# Altium project ghetto_cuda.PrjPcb (part 1 of 2)
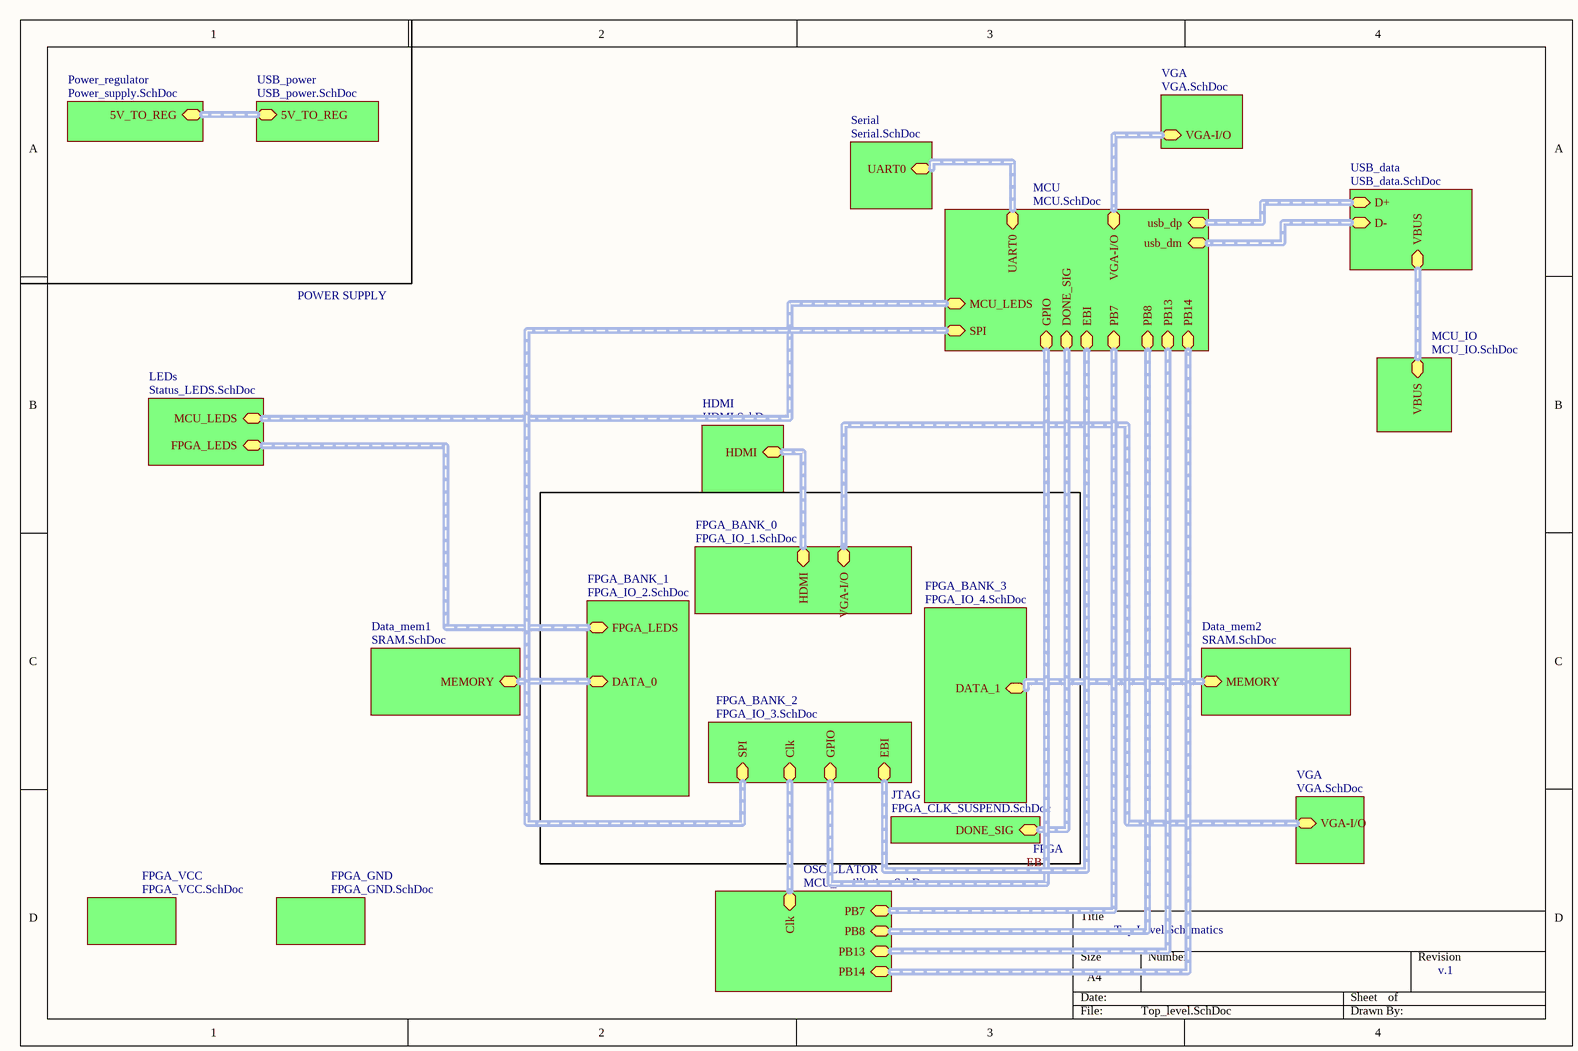
[diagram p0: Top_level.SchDoc]
19 sheets, 131 parts. Net scope: hierarchical (ports join the sheet entries above them; power ports are global).
Sheets:
  Top_level.SchDoc
    MCU = MCU.SchDoc
    USB_data = USB_data.SchDoc
    USB_power = USB_power.SchDoc
    Power_regulator = Power_supply.SchDoc
    FPGA_BANK_2 = FPGA_IO_3.SchDoc
    HDMI = HDMI.SchDoc
    VGA = VGA.SchDoc
    Data_mem1 = SRAM.SchDoc
    Serial = Serial.SchDoc
    VGA = VGA.SchDoc
    Data_mem2 = SRAM.SchDoc
    FPGA_BANK_0 = FPGA_IO_1.SchDoc
    FPGA_BANK_1 = FPGA_IO_2.SchDoc
    FPGA_BANK_3 = FPGA_IO_4.SchDoc
    JTAG = FPGA_CLK_SUSPEND.SchDoc
    FPGA_GND = FPGA_GND.SchDoc
    FPGA_VCC = FPGA_VCC.SchDoc
    LEDs = Status_LEDS.SchDoc
    MCU_IO = MCU_IO.SchDoc
    OSCILLATOR = MCU_oscilliation.SchDoc

## Sheet Top_level.SchDoc
size A4

### Sub-sheets
Data_mem1 = SRAM.SchDoc: MEMORY (harness MEMORY)
Data_mem2 = SRAM.SchDoc: MEMORY (harness MEMORY)
FPGA_BANK_0 = FPGA_IO_1.SchDoc: HDMI (harness HDMI), VGA-I/O (harness VGA-I/O)
FPGA_BANK_1 = FPGA_IO_2.SchDoc: DATA_0 (harness MEMORY), FPGA_LEDS (harness FPGA_LEDS)
FPGA_BANK_2 = FPGA_IO_3.SchDoc: EBI (harness EBI), SPI (harness SPI), Clk (harness FPGA-CLK), GPIO (harness GPIO)
FPGA_BANK_3 = FPGA_IO_4.SchDoc: DATA_1 (harness MEMORY)
FPGA_GND = FPGA_GND.SchDoc: no entries
FPGA_VCC = FPGA_VCC.SchDoc: no entries
HDMI = HDMI.SchDoc: HDMI (harness HDMI)
JTAG = FPGA_CLK_SUSPEND.SchDoc: DONE_SIG (harness DONE_SGN)
LEDs = Status_LEDS.SchDoc: MCU_LEDS (harness MCU_LEDS), FPGA_LEDS (harness FPGA_LEDS)
MCU = MCU.SchDoc: EBI (harness EBI), usb_dp (harness D+), VGA-I/O (harness VGA-I/O), usb_dm (harness D-), MCU_LEDS (harness MCU_LEDS), SPI (harness SPI), PB7 (harness PB7), PB8 (harness PB8), PB13 (harness CLK_signal), PB14 (harness CLK_signal), UART0 (harness UART0), DONE_SIG (harness DONE_SGN), GPIO (harness GPIO)
MCU_IO = MCU_IO.SchDoc: VBUS (harness VBUS)
OSCILLATOR = MCU_oscilliation.SchDoc: PB7 (harness PB7), PB13 (harness CLK_signal), PB14 (harness CLK_signal), PB8 (harness PB8), Clk (harness FPGA-CLK)
Power_regulator = Power_supply.SchDoc: 5V_TO_REG (harness 5V_TO_REG)
Serial = Serial.SchDoc: UART0 (harness UART0)
USB_data = USB_data.SchDoc: D+ (harness D+), D- (harness D-), VBUS (harness VBUS)
USB_power = USB_power.SchDoc: 5V_TO_REG (harness 5V_TO_REG)
VGA = VGA.SchDoc: VGA-I/O (harness VGA-I/O)
VGA = VGA.SchDoc: VGA-I/O (harness VGA-I/O)

### Buses and harness runs
harness EBI = sheet FPGA_BANK_2/EBI = sheet MCU/EBI
harness sheet Data_mem1/MEMORY = sheet FPGA_BANK_1/DATA_0
harness sheet Data_mem2/MEMORY = sheet FPGA_BANK_3/DATA_1
harness sheet FPGA_BANK_0/HDMI = sheet HDMI/HDMI
harness sheet FPGA_BANK_0/VGA-I/O = sheet VGA/VGA-I/O
harness sheet FPGA_BANK_1/FPGA_LEDS = sheet LEDs/FPGA_LEDS
harness sheet FPGA_BANK_2/Clk = sheet OSCILLATOR/Clk
harness sheet FPGA_BANK_2/GPIO = sheet MCU/GPIO
harness sheet FPGA_BANK_2/SPI = sheet MCU/SPI
harness sheet JTAG/DONE_SIG = sheet MCU/DONE_SIG
harness sheet LEDs/MCU_LEDS = sheet MCU/MCU_LEDS
harness sheet MCU/PB7 = sheet OSCILLATOR/PB7
harness sheet MCU/PB8 = sheet OSCILLATOR/PB8
harness sheet MCU/PB13 = sheet OSCILLATOR/PB13
harness sheet MCU/PB14 = sheet OSCILLATOR/PB14
harness sheet MCU/UART0 = sheet Serial/UART0
harness sheet MCU/usb_dm = sheet USB_data/D-
harness sheet MCU/usb_dp = sheet USB_data/D+
harness sheet MCU/VGA-I/O = sheet VGA/VGA-I/O
harness sheet MCU_IO/VBUS = sheet USB_data/VBUS
harness sheet Power_regulator/5V_TO_REG = sheet USB_power/5V_TO_REG

### Notes on the sheet
- POWER SUPPLY
- FPGA
- Top Level Schematics
- v.1

## Sheet MCU.SchDoc
size A
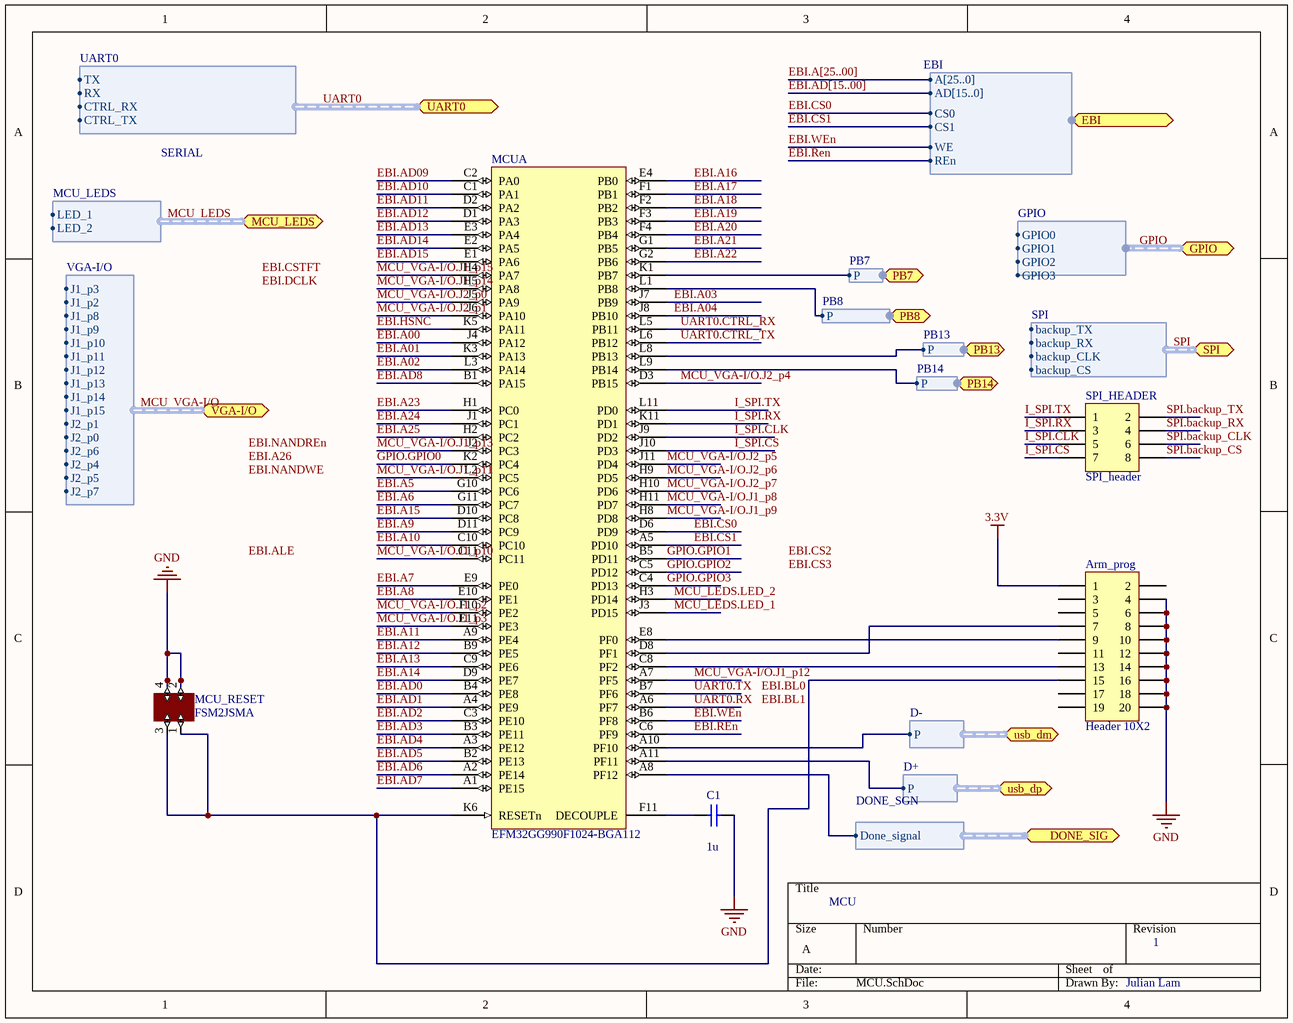
[diagram p1: MCU.SchDoc]

### Parts
Arm_prog  Header 10X2  [HDR2X10]
C1  value 1u  [C1206]
MCU  EFM32GG990F1024-BGA112  [ENMR-BGA112]  (part A of 2)
MCU_RESET  FSM2JSMA  [Button]
SPI_HEADER  SPI_header  [HDR2X4]

### Ports
DONE_SIG (harness DONE_SGN), EBI (harness EBI), GPIO (harness GPIO), MCU_LEDS (harness MCU_LEDS), PB7 (harness PB7), PB8 (harness PB8), PB13 (harness PB13), PB14 (harness PB14), SPI (harness SPI), UART0 (harness UART0), usb_dm (harness D-), usb_dp (harness D+), VGA-I/O (harness VGA-I/O)

### Harnesses
D-: P
D+: P
EBI: AD[15..0], A[25..0], CS0, WE, REn, CS1
PB7: P
PB8: P
PB13: P
PB14: P
SPI: backup_TX, backup_RX, backup_CLK, backup_CS
UART0: TX, RX, CTRL_RX, CTRL_TX
DONE_SGN: Done_signal
MCU_LEDS: LED_1, LED_2
VGA-I/O: J2_p7, J2_p5, J2_p4, J2_p6, J2_p0, J2_p1, J1_p15, J1_p14, J1_p13, J1_p12, J1_p11, J1_p10, J1_p9, J1_p8, J1_p2, J1_p3
GPIO: GPIO0, GPIO1, GPIO2, GPIO3

### Nets
3.3V: Arm_prog.1
GND: Arm_prog.4 Arm_prog.6 Arm_prog.8 Arm_prog.10 Arm_prog.12 Arm_prog.14 Arm_prog.16 Arm_prog.18 Arm_prog.20 C1.2 MCU_RESET.2 MCU_RESET.4
EBI.A00: MCU.J4(PA12)
EBI.A01: MCU.K3(PA13)
EBI.A02: MCU.L3(PA14)
EBI.A03: MCU.J7(PB9)
EBI.A04: MCU.J8(PB10)
EBI.A5: MCU.G10(PC6)
EBI.A6: MCU.G11(PC7)
EBI.A7: MCU.E9(PE0)
EBI.A8: MCU.E10(PE1)
EBI.A9: MCU.D11(PC9)
EBI.A10: MCU.C10(PC10)
EBI.A11: MCU.A9(PE4)
EBI.A12: MCU.B9(PE5)
EBI.A13: MCU.C9(PE6)
EBI.A14: MCU.D9(PE7)
EBI.A15: MCU.D10(PC8)
EBI.A16: MCU.E4(PB0)
EBI.A17: MCU.F1(PB1)
EBI.A18: MCU.F2(PB2)
EBI.A19: MCU.F3(PB3)
EBI.A20: MCU.F4(PB4)
EBI.A21: MCU.G1(PB5)
EBI.A22: MCU.G2(PB6)
EBI.A23: MCU.H1(PC0)
EBI.A24: MCU.J1(PC1)
EBI.A25: MCU.H2(PC2)
EBI.AD0: MCU.B4(PE8)  [project net DATA0]
EBI.AD1: MCU.A4(PE9)  [project net DATA1]
EBI.AD2: MCU.C3(PE10)  [project net DATA2]
EBI.AD3: MCU.B3(PE11)  [project net DATA3]
EBI.AD4: MCU.A3(PE12)  [project net DATA4]
EBI.AD5: MCU.B2(PE13)  [project net DATA5]
EBI.AD6: MCU.A2(PE14)  [project net DATA6]
EBI.AD7: MCU.A1(PE15)  [project net DATA7]
EBI.AD8: MCU.B1(PA15)  [project net DATA8]
EBI.AD09: MCU.C2(PA0)
EBI.AD10: MCU.C1(PA1)  [project net DATA10]
EBI.AD11: MCU.D2(PA2)  [project net DATA11]
EBI.AD12: MCU.D1(PA3)  [project net DATA12]
EBI.AD13: MCU.E3(PA4)  [project net DATA13]
EBI.AD14: MCU.E2(PA5)  [project net DATA14]
EBI.AD15: MCU.E1(PA6)  [project net DATA15]
EBI.CS0: MCU.D6(PD9) ; port EBI.CS0  [project net CS0]
EBI.CS1: MCU.A5(PD10) ; port EBI.CS1
EBI.HSNC: MCU.K5(PA11)
EBI.REn: MCU.C6(PF9) ; port EBI.REn
EBI.WEn: MCU.B6(PF8) ; port EBI.WE  [project net EBI.WE]
GPIO.GPIO0: MCU.K2(PC4)
GPIO.GPIO1: MCU.B5(PD11)
GPIO.GPIO2: MCU.C5(PD12)
GPIO.GPIO3: MCU.C4(PD13)
I_SPI.CLK: MCU.J9(PD2) SPI_HEADER.5
I_SPI.CS: MCU.J10(PD3) SPI_HEADER.7
I_SPI.RX: MCU.K11(PD1) SPI_HEADER.3
I_SPI.TX: MCU.L11(PD0) SPI_HEADER.1
MCU_LEDS.LED_1: MCU.J3(PD15)
MCU_LEDS.LED_2: MCU.H3(PD14)
MCU_VGA-I/O.J1_p2: MCU.F10(PE2)
MCU_VGA-I/O.J1_p3: MCU.E11(PE3)
MCU_VGA-I/O.J1_p8: MCU.H11(PD7)
MCU_VGA-I/O.J1_p9: MCU.H8(PD8)
MCU_VGA-I/O.J1_p10: MCU.C11(PC11)
MCU_VGA-I/O.J1_p11: MCU.L2(PC5)
MCU_VGA-I/O.J1_p12: MCU.A7(PF5)
MCU_VGA-I/O.J1_p13: MCU.J2(PC3)
MCU_VGA-I/O.J1_p14: MCU.H5(PA8)
MCU_VGA-I/O.J1_p15: MCU.H4(PA7)
MCU_VGA-I/O.J2_p0: MCU.J5(PA9)
MCU_VGA-I/O.J2_p1: MCU.J6(PA10)
MCU_VGA-I/O.J2_p4: MCU.D3(PB15)
MCU_VGA-I/O.J2_p5: MCU.J11(PD4)
MCU_VGA-I/O.J2_p6: MCU.H9(PD5)
MCU_VGA-I/O.J2_p7: MCU.H10(PD6)
SPI.backup_CLK: SPI_HEADER.6
SPI.backup_CS: SPI_HEADER.8
SPI.backup_RX: SPI_HEADER.4
SPI.backup_TX: SPI_HEADER.2
UART0.CTRL_RX: MCU.L5(PB11)
UART0.CTRL_TX: MCU.L6(PB12)
UART0.RX: MCU.A6(PF7)
UART0.TX: MCU.B7(PF6)
NetArm_prog_7: Arm_prog.7 MCU.D8(PF1)
NetArm_prog_9: Arm_prog.9 MCU.E8(PF0)
NetArm_prog_13: Arm_prog.13 MCU.C8(PF2)
NetArm_prog_15: Arm_prog.15 MCU.K6(RESETn) MCU_RESET.1 MCU_RESET.3
NetC1_1: C1.1 MCU.F11(DECOUPLE)
NetC21_2: MCU.K1(PB7) ; port PB7.P
NetC22_2: MCU.L1(PB8) ; port PB8.P
NetC23_2: MCU.L8(PB13) ; port PB13.P
NetC24_2: MCU.L9(PB14) ; port PB14.P
NetJTAG_1: MCU.A8(PF12) ; port DONE_SIG.Done_signal
NetL2_1: MCU.A10(PF10) ; port usb_dm.P
NetL2_4: MCU.A11(PF11) ; port usb_dp.P

Not connected (* = marked no-connect by the designer): Arm_prog 2 3 5 11 17 19

### Buses and harness runs
bus EBI.A[25..00]
bus EBI.AD[15..00]
harness GPIO = port GPIO
harness MCU_LEDS = port MCU_LEDS
harness MCU_VGA-I/O = port VGA-I/O
harness SPI = port SPI
harness UART0 = port UART0

### Notes on the sheet
- SERIAL
- MCU
- 1
- Julian Lam
- Labels drawn without touching a wire or pin: EBI.A26, EBI.ALE, EBI.BL0, EBI.BL1, EBI.CS2, EBI.CS3, EBI.CSTFT, EBI.DCLK, EBI.NANDREn, EBI.NANDWE

### Library data of the parts
Arm_prog = Header 10X2: Header, 10-Pin, Dual row; LatestRevisionDate: 17-Jul-2002; LatestRevisionNote: Re-released for DXP Platform.; Publisher: Altium Limited
C1 = Cap Semi: Capacitor (Semiconductor SIM Model); Published: 8-Jun-2000; LatestRevisionDate: 29-May-2009; LatestRevisionNote: IPC-7351 Footprint Added.; PackageReference: C1206; Publisher: Altium Limited; PackageDescription: Chip Capacitor
MCU = CMP-0270-00024-1: EFM32 Giant Gecko, M3 ARM Cortex CPU, 1024 KB Flash, 128 KB RAM, 1.85 - 3.8 V Supply, 48 MHz Max Speed, -40 to 85 degC, 112-Pin BGA, RoHS Compliant; LESENSE: Y; RAM (KB): 128; Flash (KB): 1024; LCD: 8x34; OPAMPS: 3; GPIO: 87; Max Speed (MHz): 48; ARM Cortex CPU: M3; DatasheetVersion: Rev 1.00; PartNumber: EFM32GG990F1024-BGA112; ComponentLink3Description: Package Specification; Subcategory: EFM32 Giant Gecko; PackageReference: BGA112; ComponentLink3URL: http://cdn.energymicro.com/dl/devices/pdf/d0007_efm32g290_datasheet.pdf; ComponentLink2Description: Datasheet; USB: Y; PackageDescription: 112-Pin Ball Grid Array, Body 10 x 10 mm, Pitch 0.8 mm; PackageVersion: Rev. 97SPP01315A_X03_06Jun11; ComponentLink1Description: Manufacturer URL; Supply Voltage (V): 1.85 - 3.8; Mounting Technology: Surface Mount; ComponentLink1URL: http://www.energymicro.com/; Generic Part Number: EFM32GG990; ComponentLink2URL: http://cdn.energymicro.com/dl/devices/pdf/d0046_efm32gg990_datasheet.pdf
MCU_RESET = switch-button: Reset button
SPI_HEADER = Header 4X2: Header, 4-Pin, Dual row; LatestRevisionDate: 17-Jul-2002; LatestRevisionNote: Re-released for DXP Platform.; Publisher: Altium Limited

## Sheet USB_data.SchDoc
size A4
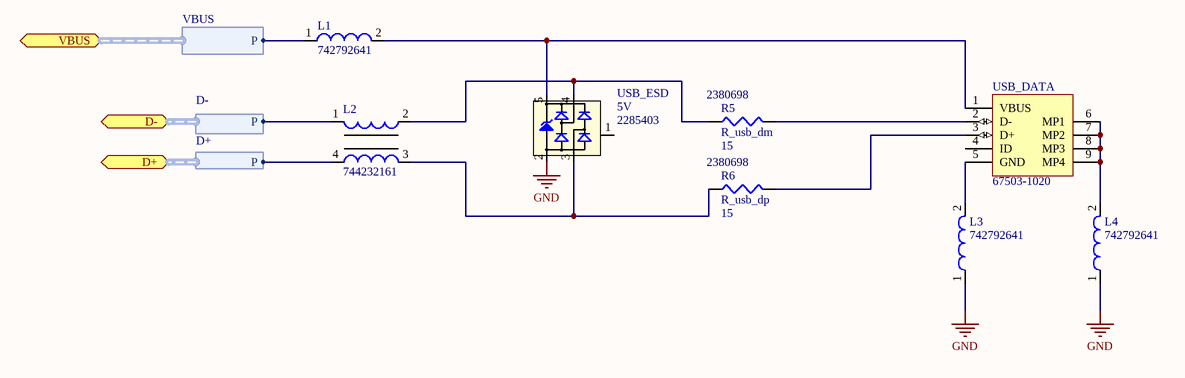
[diagram p2: USB_data.SchDoc]

### Parts
L1  742792641  [SMD-0603]
L2  744232161  [WE-CNSW-1206]
L3  742792641  [SMD-0603]
L4  742792641  [SMD-0603]
R5  R_usb_dm  value 15  Supplier Part Number 1: 2380698  [14-1210]
R6  R_usb_dp  value 15  Supplier Part Number 1: 2380698  [14-1210]
USB_DATA  67503-1020  [MOLX-67503-1020_V]
USB_ESD  5V  Supplier Part Number 1: 2285403  [SOT95P275X140-5N]

### Ports
D+ (harness D+), D- (harness D-), VBUS (harness VBUS)

### Harnesses
VBUS: P
D-: P
D+: P

### Nets
GND: L3.1 L4.1 USB_ESD.2(GND)
NetC17_2: L1.1 ; port VBUS.P
NetL1_2: L1.2 USB_DATA.1(VBUS) USB_ESD.5(VDD)
NetL2_1: L2.1 ; port D-.P
NetL2_2: L2.2 R5.1 USB_ESD.4(I/O2)
NetL2_3: L2.3 R6.1 USB_ESD.3(I/O1)
NetL2_4: L2.4 ; port D+.P
NetL3_2: L3.2 USB_DATA.5(GND)
NetL4_2: L4.2 USB_DATA.6(MP1) USB_DATA.7(MP2) USB_DATA.8(MP3) USB_DATA.9(MP4)
NetR5_2: R5.2 USB_DATA.2(D-)
NetR6_2: R6.2 USB_DATA.3(D+)

Not connected (* = marked no-connect by the designer): USB_DATA 4(ID); USB_ESD 1(NC)

### Library data of the parts
L1 L3 L4 = CMP-0220-00171-1: SMD EMI Suppression Ferrite Bead WE-CBF, Z = 300 Ohm; Impedance: 300 Ohm; PackageReference: SMD-0603; PackageVersion: 2009; ComponentLink2Description: Datasheet; ComponentLink2URL: http://www.we-online.de/katalog/media/pdf/742792641.pdf; ComponentLink1Description: Manufacturer Link; ComponentLink1URL: http://www.we-online.com; DatasheetVersion: Dec-2005; PackageDescription: Chip Inductor, 2-Leads, Body 1.6 x 0.8 mm
L2 = CMP-0222-00033-1: SMD Common Mode Noise Suppressor WE-CNSW, Z = 160 Ohm; Impedance: 160 Ohm; ComponentLink1Description: Manufacturer Link; DatasheetVersion: ver 3, Oct-2004; PackageReference: WE-CNSW-1206; PackageDescription: SMD Inductor, 4-Leads, Body 1.8 x 3.4 mm; ComponentLink1URL: http://www.we-online.com; ComponentLink2Description: Datasheet; PackageVersion: 2004; ComponentLink2URL: http://www.we-online.de/katalog/media/pdf/744232161.pdf
R5 R6 = Res3: Resistor; Manufacturer: PANASONIC; Manufacturer Part Number: ERJU14F15R0U; Product Range: PANASONIC - ERJ Series; Power Rating: 500; Resistance Tolerance: ± 1%; Resistor Case Style: 1210 [3225 Metric]; Resistor Element Material: Thick Film; Temperature Coefficient: ± 100; Voltage Rating: 200; SVHC: No SVHC (16-Dec-2013; Published: 8-Jun-2000; LatestRevisionDate: 29-May-2009; LatestRevisionNote: IPC-7351 Footprint Added.; PackageReference: J1-0603; Publisher: Altium Limited; PackageDescription: Chip Resistor; Supplier 1: Farnell; RoHS: YES; Stock 1: 3740; Pricing 1: 10=1,05, 100=0,951, 500=0,734, 1000=0,589, 5000=0,434 (EUR); Resistance: 15; Packaging: Cut Tape; MSL: -; ComponentLink1URL: http://www.farnell.com/datasheets/1783557.pdf; ComponentLink1Description: http://www.farnell.com/datasheets/1783557.pdf
USB_DATA = CMP-0411-00002-1: USB, MINI, SMD, RA KME04-USBMU03A01; Manufacturer: Molex; ComponentLink1URL: http://www.molex.com/; PartNumber: 67503-1020; Mounting Technology: Surface Mount; ComponentLink1Description: Manufacturer URL; Terminal Pitch: 0.8 mm; DatasheetVersion: Rev F, 06/2009; ComponentLink2Description: Datasheet; PackageDescription: Mini USB Connector, SMT, Righer Angle; ComponentLink2URL: http://www.molex.com/pdm_docs/sd/675031020_sd.pdf; PackageReference: 67503-1020
USB_ESD = WE-TVS-HS,SOT23-5L,824011: TVS Diode WE-TVS-HS, VRWM=5V; PartNo: 824011; Manufacturer: Würth Elektronik eiSos GmbH; Manufacturer Part Number: DZ5X068D0R; Reverse Stand Off Voltage: 5V; ComponentLink1Description: Manufacturer; ComponentLink1URL: http://www.we-online.de; Created by: Christin Zierenner; Created Date: March 2010; ComponentLink2Description: Datasheet; ComponentLink2URL: http://katalog.we-online.de/kataloge/eisos/media/pdf/824011.pdf; Supplier 1: Farnell; RoHS: YES; Stock 1: 901; Pricing 1: 1=1,2, 25=0,93, 100=0,77, 500=0,74, 1000=0,73, 3000=0,71, 3000=0,639, 40000=0,615 (EUR); ComponentLink3URL: http://www.semicon.panasonic.co.jp/ds4/DZ5X068D_BED.pdf; ComponentLink3Description: http://www.semicon.panasonic.co.jp/ds4/DZ5X068D_BED.pdf

## Sheet USB_power.SchDoc
size A4
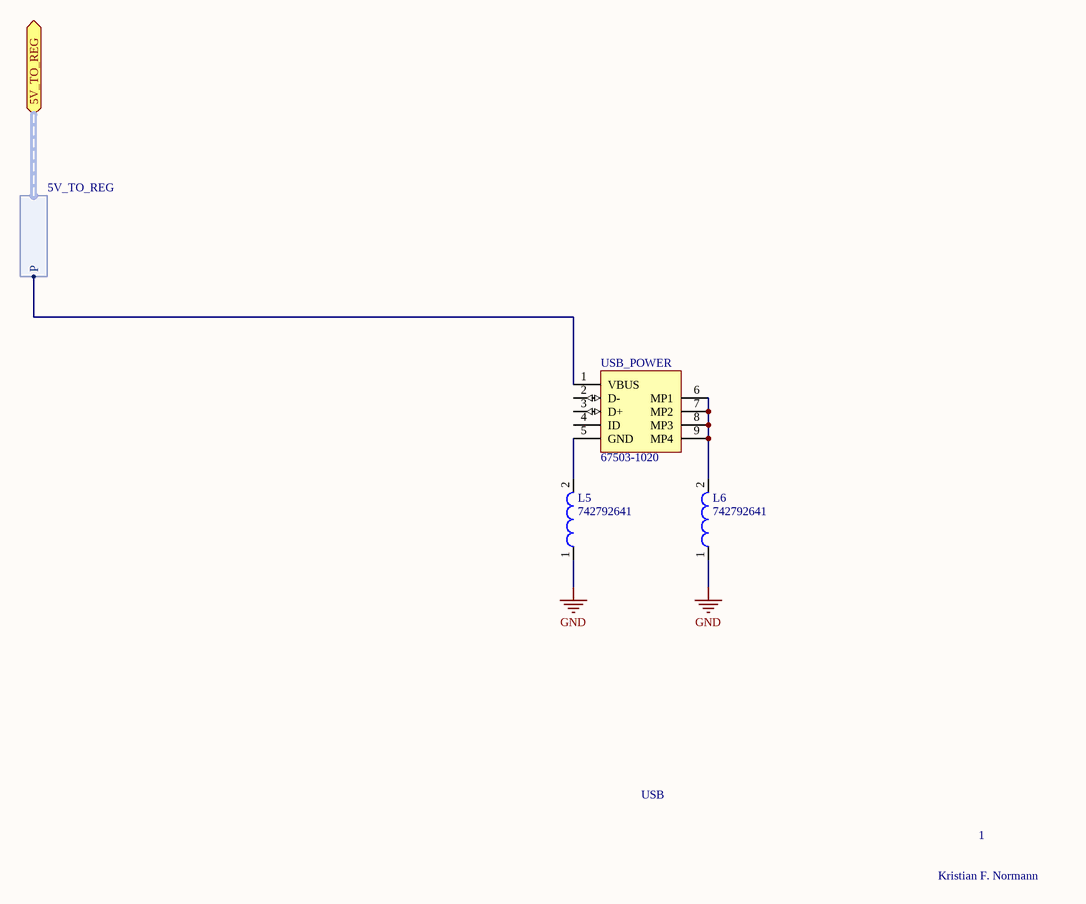
[diagram p3: USB_power.SchDoc]

### Parts
L5  742792641  [SMD-0603]
L6  742792641  [SMD-0603]
USB_POWER  67503-1020  [MOLX-67503-1020_V]

### Ports
5V_TO_REG (harness 5V_TO_REG)

### Harnesses
5V_TO_REG: P

### Nets
GND: L5.1 L6.1
NetL5_2: L5.2 USB_POWER.5(GND)
NetL6_2: L6.2 USB_POWER.6(MP1) USB_POWER.7(MP2) USB_POWER.8(MP3) USB_POWER.9(MP4)
NetP5_1: USB_POWER.1(VBUS) ; port 5V_TO_REG.P

Not connected (* = marked no-connect by the designer): USB_POWER 2(D-) 3(D+) 4(ID)

### Notes on the sheet
- USB
- 1
- Kristian F. Normann

### Library data of the parts
L5 L6 = CMP-0220-00171-1: as L1 on sheet USB_data; PackageReference: SMD-0603; PackageVersion: 2009; ComponentLink2Description: Datasheet; ComponentLink2URL: http://www.we-online.de/katalog/media/pdf/742792641.pdf; ComponentLink1Description: Manufacturer Link; ComponentLink1URL: http://www.we-online.com; DatasheetVersion: Dec-2005; PackageDescription: Chip Inductor, 2-Leads, Body 1.6 x 0.8 mm
USB_POWER = CMP-0411-00002-1: as USB_DATA on sheet USB_data; ComponentLink1URL: http://www.molex.com/; PartNumber: 67503-1020; Mounting Technology: Surface Mount; ComponentLink1Description: Manufacturer URL; Terminal Pitch: 0.8 mm; DatasheetVersion: Rev F, 06/2009; ComponentLink2Description: Datasheet; PackageDescription: Mini USB Connector, SMT, Righer Angle; ComponentLink2URL: http://www.molex.com/pdm_docs/sd/675031020_sd.pdf; PackageReference: 67503-1020

## Sheet Power_supply.SchDoc
size A4
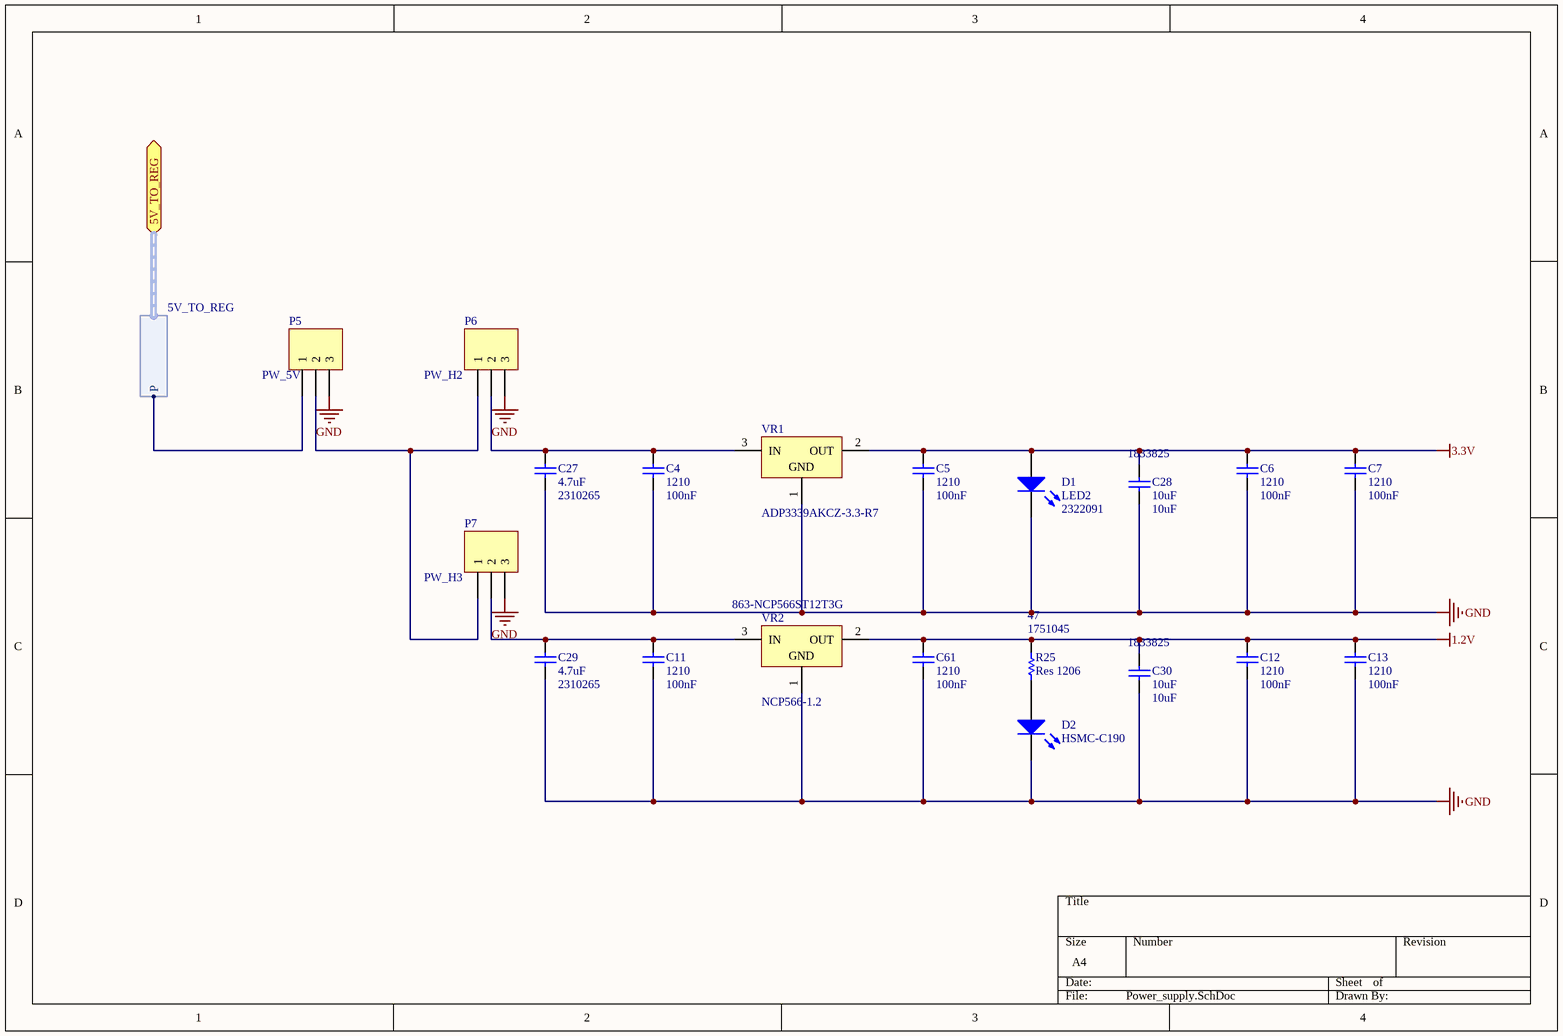
[diagram p4: Power_supply.SchDoc]

### Parts
C4  1210  value 100nF  [CAPC1210(3225)105_L]
C5  1210  value 100nF  [CAPC1210(3225)105_L]
C6  1210  value 100nF  [CAPC1210(3225)105_L]
C7  1210  value 100nF  [CAPC1210(3225)105_L]
C11  1210  value 100nF  [CAPC1210(3225)105_L]
C12  1210  value 100nF  [CAPC1210(3225)105_L]
C13  1210  value 100nF  [CAPC1210(3225)105_L]
C27  4.7uF  Supplier Part Number 1: 2310265  [C1206]
C28  10uF  Supplier Part Number 1: 1833825  [C1206]
C29  4.7uF  Supplier Part Number 1: 2310265  [C1206]
C30  10uF  Supplier Part Number 1: 1833825  [C1206]
C61  1210  value 100nF  [CAPC1210(3225)105_L]
D1  LED2  Supplier Part Number 1: 2322091  [C1206]
D2  HSMC-C190  [1.6X0.8X0.8]
P5  PW_5V  [HDR1X3]
P6  PW_H2  [HDR1X3]
P7  PW_H3  [HDR1X3]
R25  Res 1206  Supplier Part Number 1: 1751045  Resistance: 47  [RESC1206(3216)_L]
VR1  ADP3339AKCZ-3.3-R7  [ADI-KC-3_M]
VR2  NCP566-1.2  Supplier Part Number 1: 863-NCP566ST12T3G  [SOT223_N]

### Ports
5V_TO_REG (harness 5V_TO_REG)

### Harnesses
5V_TO_REG: P

### Nets
1.2V: C12.2 C13.2 C30.2 C61.2 R25.1 VR2.2(OUT)
3.3V: C5.2 C6.2 C7.2 C28.2 D1.1(A) VR1.2(OUT)
GND: C4.1 C5.1 C6.1 C7.1 C11.1 C12.1 C13.1 C27.1 C28.1 C29.1 C30.1 C61.1 D1.2(K) D2.2(K) P5.3 P6.3 P7.3 VR1.1(GND) VR2.1(GND)
NetC4_2: C4.2 C27.2 P6.2 VR1.3(IN)
NetC11_2: C11.2 C29.2 P7.2 VR2.3(IN)
NetD2_1: D2.1(A) R25.2
NetP5_1: P5.1 ; port 5V_TO_REG.P
NetP5_2: P5.2 P6.1 P7.1

### Library data of the parts
C4-C7 C11-C13 C61 = CMP-1038-01663-1: CAP 100nF 100V ±5% 1210 (3225 Metric) Thickness 1.05mm SMD; Case-Metric: 3225; Max Thickness: 1.05 mm; Rated Voltage: 100 V; Tolerance: ±5%; Case-EIA: 1210; Technology: SMT
C27 C29 = Cap Semi: Capacitor (Semiconductor SIM Model); Manufacturer: AVX; Manufacturer Part Number: 12061Z475KAT2A; Value: 100pF; Capacitance: 4.7; Capacitance Tolerance: ± 10%; Dielectric Characteristic: X7; Voltage Rating: 100; Ceramic Capacitor Case: 1206 [3216 Metric]; SVHC: No SVHC (16-Jun-2014); Capacitor Terminals: SMD<!--FANDB--><div class="features-and-benefits-container"></div>; Published: 8-Jun-2000; LatestRevisionDate: 29-May-2009; LatestRevisionNote: IPC-7351 Footprint Added.; PackageReference: C1206; Publisher: Altium Limited; PackageDescription: Chip Capacitor; Supplier 1: Farnell; RoHS: YES; Stock 1: 213; Pricing 1: 1=6,85, 50=6,2, 100=4,8, 1000=3,85, 2000=2,45 (EUR); Product Range: -; Operating Temperature Min: -55; Operating Temperature Max: 125; Packaging: Cut Tape; MSL: MSL 1 - Unlimited; Capacitance Tolerance ±: ± 10%; Capacitor Case Style: 1206 [3216 Metric]; ComponentLink1URL: http://www.farnell.com/datasheets/1789384.pdf; ComponentLink1Description: http://www.farnell.com/datasheets/1789384.pdf
C28 C30 = Cap Semi: Capacitor (Semiconductor SIM Model); Manufacturer: AVX; Manufacturer Part Number: 12063D106KAT2A; Capacitance: 10; Capacitance Tolerance: ± 10%; Dielectric Characteristic: X5; Voltage Rating: 25; Ceramic Capacitor Case: 1206 [3216 Metric]; SVHC: No SVHC (16-Dec-2013); Capacitor Terminals: SMD; Published: 8-Jun-2000; LatestRevisionDate: 29-May-2009; LatestRevisionNote: IPC-7351 Footprint Added.; PackageReference: C1206; Publisher: Altium Limited; PackageDescription: Chip Capacitor; Value: 10uF; Supplier 1: Farnell; RoHS: YES; Stock 1: 16889; Pricing 1: 10=3.58, 100=2.42, 500=1.21, 1000=1, 2000=0.8 (EUR); Product Range: -; Operating Temperature Min: -55; Operating Temperature Max: 85; Packaging: Cut Tape; MSL: MSL 1 - Unlimited; Capacitance Tolerance ±: ± 10%; Capacitor Case Style: 1206 [3216 Metric]; Operating Temperature Range: -55°C to +85; Series: Hi-Cap MLCC<!--FANDB--><div class="features-and-benefits-container"></div>; ComponentLink1URL: http://www.farnell.com/datasheets/1796776.pdf; ComponentLink1Description: http://www.farnell.com/datasheets/1796776.pdf
D1 = LED2: Typical RED, GREEN, YELLOW, AMBER GaAs LED; Manufacturer: WURTH ELEKTRONIK; Manufacturer Part Number: 156120GS75300; Published: 8-Jun-2000; LatestRevisionDate: 17-Jul-2002; LatestRevisionNote: Re-released for DXP Platform.; PackageVersion: Feb-2002; PackageReference: 3.2X1.6X1.1; Publisher: Altium Limited; PackageDescription: SM LED; 2 Flat Leads; Supplier 1: Farnell; RoHS: YES; Stock 1: 15358; Pricing 1: 1=5,3, 50=4,9, 100=4,6, 500=3,65, 2000=3,3, 5000=2,95, 5000=2,65, 30000=2,4 (EUR); ComponentLink1URL: http://katalog.we-online.de/led/datasheet/156120GS75300.pdf; ComponentLink1Description: http://katalog.we-online.de/led/datasheet/156120GS75300.pdf
D2 = HSMC-C190: High Performance Chip LED, Red; LuminousIntensity: 25mcd (Minimum).; PCB_Layout: Complies with manufacturer's recommendation.; Published: 11-Dec-2002; DatasheetVersion: 11-Mar-2002; PackageVersion: Mar-2002; PackageReference: 1.6X0.8X0.8; Publisher: Altium Limited; PackageDescription: SM LED; 2 Flat Leads; LED_Colour: Red; ComponentLink1Description: Manufacturer Link; ComponentLink1URL: http://www.avagotech.com/; ComponentLink2Description: Datasheet; ComponentLink2URL: http://cp.literature.agilent.com/litweb/pdf/5988-5891EN.pdf
P5-P7 = Header 3: Header, 3-Pin; LatestRevisionDate: 17-Jul-2002; LatestRevisionNote: Re-released for DXP Platform.; Publisher: Altium Limited
R25 = CMP-1014-00056-1: 105R 0.25W 5% 1206 (3216 Metric)  SMD; Manufacturer: PANASONIC; Manufacturer Part Number: ERJB2AF470V; Case-Metric: 3216; Case-EIA: 1206; Product Range: PANASONIC - ERJ Wide Terminal Series; Power Rating: 0.5; Resistance Tolerance: ± 1%; Resistor Case Style: 1206 Wide; Resistor Element Material: Thick Film; Temperature Coefficient: ± 100; Voltage Rating: 200; SVHC: No SVHC (16-Dec-2013); External Depth: 1.6; External Length / Height: 0.65; External Width: 3.2; No. of Pins: 2; Overload Voltage: 400; Reel Quantity: 5000; Technology: SMT; Tolerance: 5 %; Value: 105R; Power: 0.25 W; Supplier 1: Farnell; RoHS: YES; Stock 1: 185; Pricing 1: 5=1,83, 50=1,71, 100=1,61, 500=1,52, 5000=1,44 (EUR); Packaging: Cut Tape; MSL: -; Operating Temperature Max: 155; Operating Temperature Min: -55; Operating Temperature Range: -55°C to +155; Resistor Mounting: SMD; Series: ERJ<!--FANDB--><div class="features-and-benefits-container"></div>; ComponentLink1URL: http://www.farnell.com/datasheets/436795.pdf; ComponentLink1Description: http://www.farnell.com/datasheets/436795.pdf; ComponentLink2URL: http://www.farnell.com/datasheets/1718548.pdf; ComponentLink2Description: http://www.farnell.com/datasheets/1718548.pdf; ComponentLink3URL: http://www.farnell.com/cad/1697905.zip; ComponentLink3Description: http://www.farnell.com/cad/1697905.zip
VR1 = CMP-0786-00156-1: High Accuracy, Ultralow IQ, 1.5 A, anyCAP Low Dropout Regulator, 2.8 to 6 V Vin, 3.3 V Vout, Industrial, 3-pin SOT223 (KC-3), Reel; Manufacturer: Analog Devices; Vin (max) (V): 6; Supply Current IGND @ Small Load: 130uA; Iout max: 1.5A; Preset Vout Values (V): 3.3; Vin (min) (V): 2.8; Code_JEDEC: TO-261-AA; ComponentLink3URL: http:/www.analog.com/static/imported-files/packages/PKG_PDF/SOT_223(KC)/KC_3.pdf; ComponentLink4URL: Product URL:http://www.analog.com/en/ADP3339/productSearch.html; Mounting Technology: Surface Mount; ComponentLink2URL: http://www.analog.com/static/imported-files/data_sheets/ADP3339.pdf; DatasheetVersion: Rev. C; ComponentLink1URL: http://www.analog.com/en/index.html; PackageDescription: 3-Pin Small Outline Transistor Package, Body 3.5 x 6.5 mm, Pitch 2.3 mm; Packing: Reel; PartNumber: ADP3339AKCZ-3.3-R7; ComponentLink3Description: Package Specification; PackageReference: KC-3; ComponentLink1Description: Manufacturer URL; ComponentLink2Description: Datasheet; PackageVersion: 11-20-2012-B, 11/2012; ComponentLink4Description: URL Link1
VR2 = LM1084IT-3.3: 5A Low Dropout Positive Regulators, 3-pin TO-220; Manufacturer: ON Semiconductor; Manufacturer Part Number: NCP566ST12T3G; Input Voltage MAX: 9 V; Number of Outputs: 1 Output; Output Current: 1.5 A; Output Type: Fixed; Output Voltage: 1.2 V; Dropout Voltage - Max: 1.3 V at 1.5 mA; Voltage Regulation Accuracy: 3 %; Line Regulation: 0.02 %; Load Regulation: 0.04 %; Reference Voltage: 0.9 V; Supplier 1: Mouser; RoHS: RoHS Compliant; Category: LDO Voltage Regulators; Stock 1: 3461; Pricing 1: 1=1.42, 10=1.13, 100=0.871, 500=0.770, 1000=0.608, 4000=0.539, 8000=0.518, 24000=0.502 (AUD); Package / Case: SOT-223; Packaging: Reel; Series: NCP566; Brand: ON Semiconductor; Mounting Style: SMD/SMT; Maximum Operating Temperature: + 125 C; Minimum Operating Temperature: - 40 C; Product Category: Amplifiers- Audio; Standard Pack Qty: 4000; RoHS - Mouser: Y; Minimum Order Quantity: 1; Reeling: True; ComponentLink1URL: http://www.farnell.com/datasheets/115299.pdf; ComponentLink1Description: http://www.farnell.com/datasheets/115299.pdf

## Sheet FPGA_IO_3.SchDoc
size A
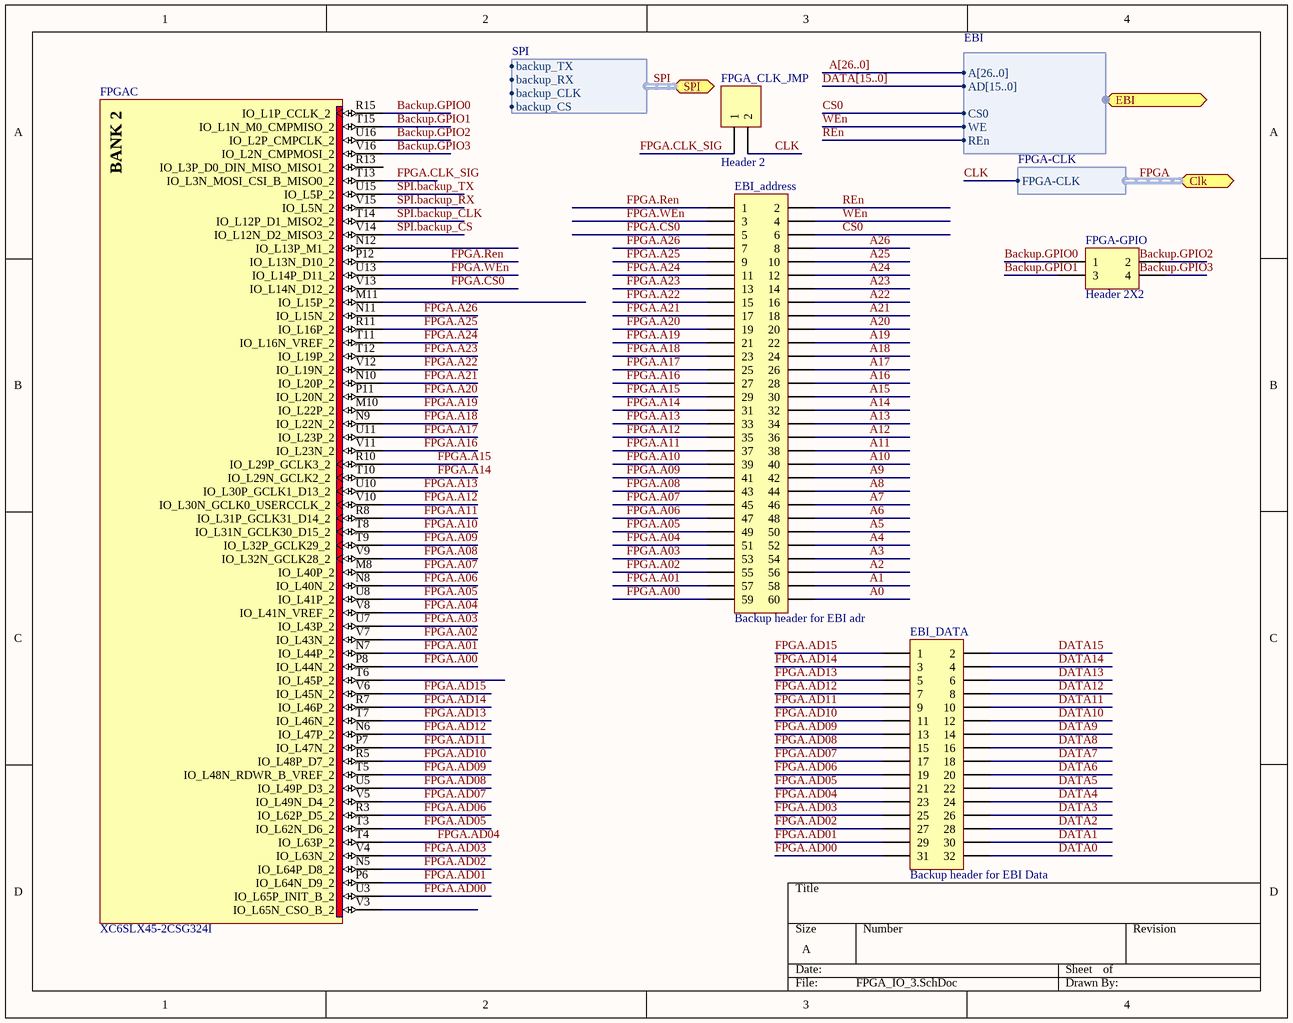
[diagram p5: FPGA_IO_3.SchDoc]

### Parts
EBI_address  Backup header for EBI adr  [HDR2X30]
EBI_DATA  Backup header for EBI Data  [HDR2X16]
FPGA  XC6SLX45-2CSG324I  [CSG324]  (part C of 8)
FPGA-GPIO  Header 2X2  [HDR2X2]
FPGA_CLK_JMP  Header 2  [HDR1X2]

### Ports
Clk (harness FPGA-CLK), EBI (harness EBI), SPI (harness SPI)

### Harnesses
EBI: AD[15..0], A[26..0], CS0, WE, REn
FPGA-CLK: FPGA-CLK
SPI: backup_TX, backup_RX, backup_CLK, backup_CS

### Nets
A0: EBI_address.60
A1: EBI_address.58
A2: EBI_address.56
A3: EBI_address.54
A4: EBI_address.52
A5: EBI_address.50
A6: EBI_address.48
A7: EBI_address.46
A8: EBI_address.44
A9: EBI_address.42
A10: EBI_address.40
A11: EBI_address.38
A12: EBI_address.36
A13: EBI_address.34
A14: EBI_address.32
A15: EBI_address.30
A16: EBI_address.28
A17: EBI_address.26
A18: EBI_address.24
A19: EBI_address.22
A20: EBI_address.20
A21: EBI_address.18
A22: EBI_address.16
A23: EBI_address.14
A24: EBI_address.12
A25: EBI_address.10
A26: EBI_address.8
Backup.GPIO0: FPGA.R15(IO_L1P_CCLK_2) FPGA-GPIO.1
Backup.GPIO1: FPGA.T15(IO_L1N_M0_CMPMISO_2) FPGA-GPIO.3
Backup.GPIO2: FPGA.U16(IO_L2P_CMPCLK_2)
Backup.GPIO3: FPGA.V16(IO_L2N_CMPMOSI_2)
CLK: FPGA_CLK_JMP.2 ; port Clk.FPGA-CLK
CS0: EBI_address.6 ; port EBI.CS0
DATA0: EBI_DATA.32
DATA1: EBI_DATA.30
DATA2: EBI_DATA.28
DATA3: EBI_DATA.26
DATA4: EBI_DATA.24
DATA5: EBI_DATA.22
DATA6: EBI_DATA.20
DATA7: EBI_DATA.18
DATA8: EBI_DATA.16
DATA9: EBI_DATA.14
DATA10: EBI_DATA.12
DATA11: EBI_DATA.10
DATA12: EBI_DATA.8
DATA13: EBI_DATA.6
DATA14: EBI_DATA.4
DATA15: EBI_DATA.2
FPGA.A00: EBI_address.59 FPGA.P8(IO_L44N_2)
FPGA.A01: EBI_address.57 FPGA.N7(IO_L44P_2)
FPGA.A02: EBI_address.55 FPGA.V7(IO_L43N_2)
FPGA.A03: EBI_address.53 FPGA.U7(IO_L43P_2)
FPGA.A04: EBI_address.51 FPGA.V8(IO_L41N_VREF_2)
FPGA.A05: EBI_address.49 FPGA.U8(IO_L41P_2)
FPGA.A06: EBI_address.47 FPGA.N8(IO_L40N_2)
FPGA.A07: EBI_address.45 FPGA.M8(IO_L40P_2)
FPGA.A08: EBI_address.43 FPGA.V9(IO_L32N_GCLK28_2)
FPGA.A09: EBI_address.41 FPGA.T9(IO_L32P_GCLK29_2)
FPGA.A10: EBI_address.39 FPGA.T8(IO_L31N_GCLK30_D15_2)
FPGA.A11: EBI_address.37 FPGA.R8(IO_L31P_GCLK31_D14_2)
FPGA.A12: EBI_address.35 FPGA.V10(IO_L30N_GCLK0_USERCCLK_2)
FPGA.A13: EBI_address.33 FPGA.U10(IO_L30P_GCLK1_D13_2)
FPGA.A14: EBI_address.31 FPGA.T10(IO_L29N_GCLK2_2)
FPGA.A15: EBI_address.29 FPGA.R10(IO_L29P_GCLK3_2)
FPGA.A16: EBI_address.27 FPGA.V11(IO_L23N_2)
FPGA.A17: EBI_address.25 FPGA.U11(IO_L23P_2)
FPGA.A18: EBI_address.23 FPGA.N9(IO_L22N_2)
FPGA.A19: EBI_address.21 FPGA.M10(IO_L22P_2)
FPGA.A20: EBI_address.19 FPGA.P11(IO_L20N_2)
FPGA.A21: EBI_address.17 FPGA.N10(IO_L20P_2)
FPGA.A22: EBI_address.15 FPGA.V12(IO_L19N_2)
FPGA.A23: EBI_address.13 FPGA.T12(IO_L19P_2)
FPGA.A24: EBI_address.11 FPGA.T11(IO_L16N_VREF_2)
FPGA.A25: EBI_address.9 FPGA.R11(IO_L16P_2)
FPGA.A26: EBI_address.7 FPGA.N11(IO_L15N_2)
FPGA.AD00: EBI_DATA.31 FPGA.U3(IO_L65P_INIT_B_2)
FPGA.AD01: EBI_DATA.29 FPGA.P6(IO_L64N_D9_2)
FPGA.AD02: EBI_DATA.27 FPGA.N5(IO_L64P_D8_2)
FPGA.AD03: EBI_DATA.25 FPGA.V4(IO_L63N_2)
FPGA.AD04: EBI_DATA.23 FPGA.T4(IO_L63P_2)
FPGA.AD05: EBI_DATA.21 FPGA.T3(IO_L62N_D6_2)
FPGA.AD06: EBI_DATA.19 FPGA.R3(IO_L62P_D5_2)
FPGA.AD07: EBI_DATA.17 FPGA.V5(IO_L49N_D4_2)
FPGA.AD08: EBI_DATA.15 FPGA.U5(IO_L49P_D3_2)
FPGA.AD09: EBI_DATA.13 FPGA.T5(IO_L48N_RDWR_B_VREF_2)
FPGA.AD10: EBI_DATA.11 FPGA.R5(IO_L48P_D7_2)
FPGA.AD11: EBI_DATA.9 FPGA.P7(IO_L47N_2)
FPGA.AD12: EBI_DATA.7 FPGA.N6(IO_L47P_2)
FPGA.AD13: EBI_DATA.5 FPGA.T7(IO_L46N_2)
FPGA.AD14: EBI_DATA.3 FPGA.R7(IO_L46P_2)
FPGA.AD15: EBI_DATA.1 FPGA.V6(IO_L45N_2)
FPGA.CLK_SIG: FPGA.T13(IO_L3N_MOSI_CSI_B_MISO0_2) FPGA_CLK_JMP.1
FPGA.CS0: EBI_address.5 FPGA.V13(IO_L14N_D12_2)
FPGA.Ren: EBI_address.1 FPGA.P12(IO_L13N_D10_2)
FPGA.WEn: EBI_address.3 FPGA.U13(IO_L14P_D11_2)
REn: EBI_address.2 ; port EBI.REn  [project net EBI.REn]
SPI.backup_CLK: FPGA.T14(IO_L12P_D1_MISO2_2)
SPI.backup_CS: FPGA.V14(IO_L12N_D2_MISO3_2)
SPI.backup_RX: FPGA.V15(IO_L5N_2)
SPI.backup_TX: FPGA.U15(IO_L5P_2)
WEn: EBI_address.4 ; port EBI.WE  [project net EBI.WE]

Not connected (* = marked no-connect by the designer): FPGA M11(IO_L15P_2) N12(IO_L13P_M1_2) R13(IO_L3P_D0_DIN_MISO_MISO1_2) T6(IO_L45P_2) V3(IO_L65N_CSO_B_2); FPGA-GPIO 2 4

### Buses and harness runs
bus A[26..0]
bus DATA[15..0]
harness FPGA = port Clk
harness SPI = port SPI

### Notes on the sheet
- Labels drawn without touching a wire or pin: Backup.GPIO2, Backup.GPIO3
- (in symbol CMP-0067-00402-1, part C) BANK 2

### Library data of the parts
EBI_address = Header 30X2: Header, 30-Pin, Dual row; LatestRevisionDate: 17-Jul-2002; LatestRevisionNote: Re-released for DXP Platform.; Publisher: Altium Limited
EBI_DATA = Header 16X2: Header, 16-Pin, Dual row; LatestRevisionDate: 17-Jul-2002; LatestRevisionNote: Re-released for DXP Platform.; Publisher: Altium Limited
FPGA = CMP-0067-00402-1: Spartan-6 LX 1.2V FPGA, 218 User I/Os, 324-Ball Chip-Scale BGA (0.8mm Pitch), Speed Grade 2, Industrial Grade, Pb-Free; Code_JEDEC: MO-275-KKAC-1; PackageDescription: 324-Ball Chip-Scale BGA (CSG324) Package, 0.8 mm Pitch; DatasheetVersion: ver1.6, Nov-2010; PackageVersion: ver1.1, Nov-2009; PackageReference: CSG324
FPGA-GPIO = Header 2X2: Header, 2-Pin, Dual row; LatestRevisionDate: 17-Jul-2002; LatestRevisionNote: Re-released for DXP Platform.; Publisher: Altium Limited
FPGA_CLK_JMP = Header 2: Header, 2-Pin; LatestRevisionDate: 17-Jul-2002; LatestRevisionNote: Re-released for DXP Platform.; Publisher: Altium Limited

## Sheet HDMI.SchDoc
size A4
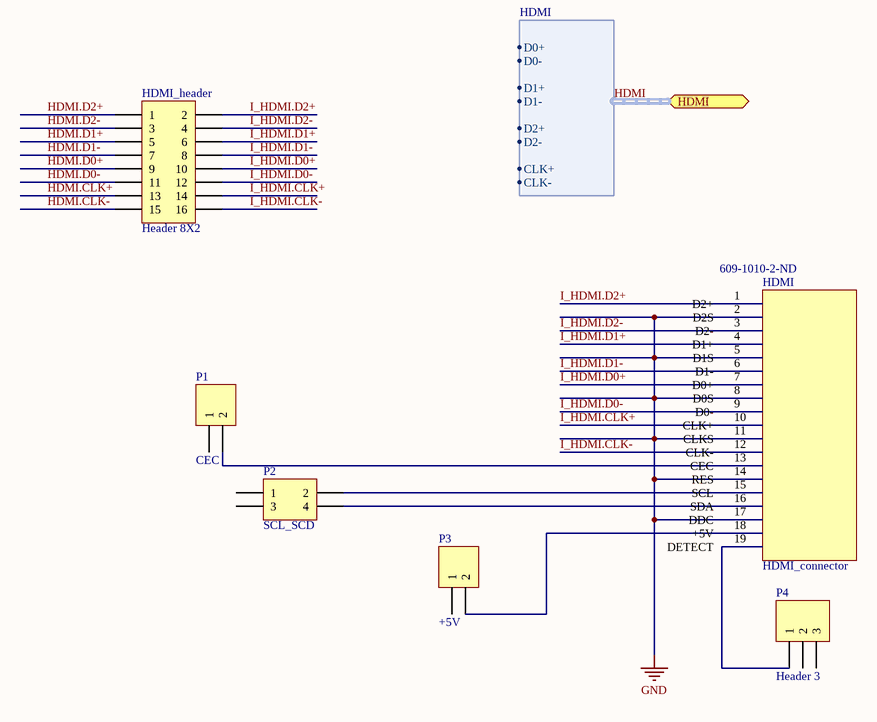
[diagram p6: HDMI.SchDoc]

### Parts
HDMI  HDMI_connector  Supplier Part Number 1: 609-1010-2-ND  [HDMI-type-A]
HDMI_header  Header 8X2  [HDR2X8]
P1  CEC  [HDR1X2]
P2  SCL_SCD  [HDR2X2]
P3  +5V  [HDR1X2]
P4  Header 3  [HDR1X3]

### Ports
HDMI (harness HDMI)

### Harnesses
HDMI: D0+, D0-, D1+, D1-, D2+, D2-, CLK+, CLK-

### Nets
GND: HDMI.2(D2S) HDMI.5(D1S) HDMI.8(D0S) HDMI.11(CLKS) HDMI.14(RES) HDMI.17(DDC)
HDMI.CLK+: HDMI_header.13
HDMI.CLK-: HDMI_header.15
HDMI.D0+: HDMI_header.9
HDMI.D0-: HDMI_header.11
HDMI.D1+: HDMI_header.5
HDMI.D1-: HDMI_header.7
HDMI.D2+: HDMI_header.1
HDMI.D2-: HDMI_header.3
I_HDMI.CLK+: HDMI.10(CLK+) HDMI_header.14
I_HDMI.CLK-: HDMI.12(CLK-) HDMI_header.16
I_HDMI.D0+: HDMI.7(D0+) HDMI_header.10
I_HDMI.D0-: HDMI.9(D0-) HDMI_header.12
I_HDMI.D1+: HDMI.4(D1+) HDMI_header.6
I_HDMI.D1-: HDMI.6(D1-) HDMI_header.8
I_HDMI.D2+: HDMI.1(D2+) HDMI_header.2
I_HDMI.D2-: HDMI.3(D2-) HDMI_header.4
NetHDMI_13: HDMI.13(CEC) P1.2
NetHDMI_15: HDMI.15(SCL) P2.2
NetHDMI_16: HDMI.16(SDA) P2.4
NetHDMI_18: HDMI.18(+5V) P3.2
NetHDMI_19: HDMI.19(DETECT) P4.1

Not connected (* = marked no-connect by the designer): P1 1; P2 1 3; P3 1; P4 2 3

### Buses and harness runs
harness HDMI = port HDMI

### Library data of the parts
HDMI = HDMI_connector: Manufacturer: FCI; Manufacturer Part Number: 10029449-001RLF; Connector Type: HDMI; Number of Contacts: 19; Gender: Receptacle; Supplier 1: Digi-Key; RoHS: RoHS Compliant; Category: Connectors, Interconnects; Stock 1: 12400; Pricing 1: 400=0.69795, 800=0.61071, 1200=0.55837, 2000=0.52347, 2800=0.50601, 10000=0.46414, 20000=0.45367 (EUR); Packaging: Tape & Reel (TR); Specifications: -; Mounting Type: Surface Mount, Right Angle, Horizontal; Features: -; Ingress Protection: -; ComponentLink1URL: http://portal.fciconnect.com/Comergent//fci/drawing/10029449.pdf; ComponentLink1Description: http://portal.fciconnect.com/Comergent//fci/drawing/10029449.pdf
HDMI_header = Header 8X2: Header, 8-Pin, Dual row; LatestRevisionDate: 17-Jul-2002; LatestRevisionNote: Re-released for DXP Platform.; Publisher: Altium Limited
P1 P3 = Header 2: Header, 2-Pin; LatestRevisionDate: 17-Jul-2002; LatestRevisionNote: Re-released for DXP Platform.; Publisher: Altium Limited
P2 = Header 2X2: Header, 2-Pin, Dual row; LatestRevisionDate: 17-Jul-2002; LatestRevisionNote: Re-released for DXP Platform.; Publisher: Altium Limited
P4 = Header 3: Header, 3-Pin; LatestRevisionDate: 17-Jul-2002; LatestRevisionNote: Re-released for DXP Platform.; Publisher: Altium Limited

## Sheet VGA.SchDoc
size A4
Used 2 times, as channels VGA, VGA. Parts and nets are listed once, with the designators drawn on the sheet.
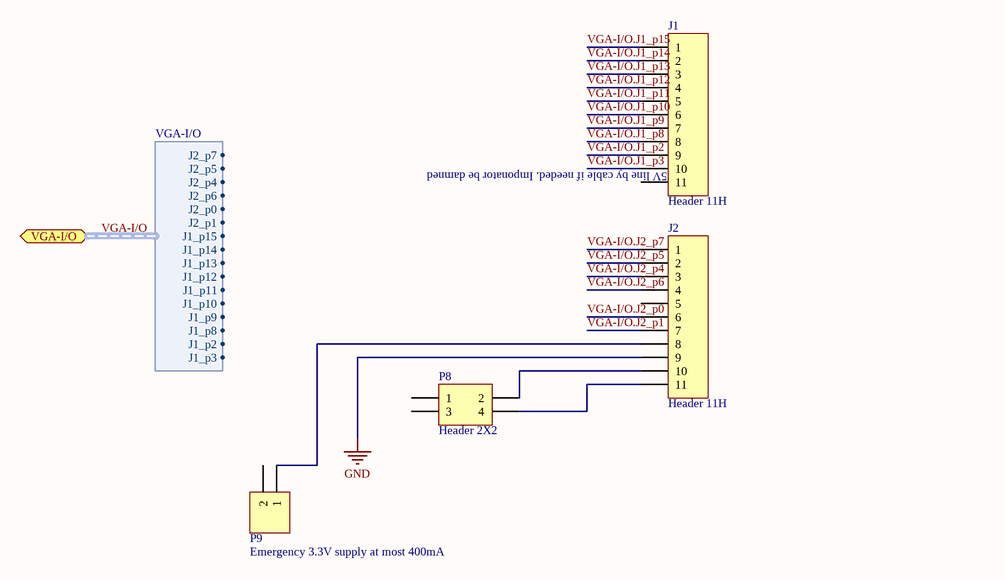
[diagram p7: VGA.SchDoc]

### Parts
J1  Header 11H  [HDR1X11H]
J2  Header 11H  [HDR1X11H]
P8  Header 2X2  [HDR2X2]
P9  Emergency 3.3V supply at most 400mA  [HDR1X2]

### Ports
VGA-I/O (harness VGA-I/O)

### Harnesses
VGA-I/O: J2_p7, J2_p5, J2_p4, J2_p6, J2_p0, J2_p1, J1_p15, J1_p14, J1_p13, J1_p12, J1_p11, J1_p10, J1_p9, J1_p8, J1_p2, J1_p3

### Nets
GND: J2.9
VGA-I/O.J1_p2: J1.9
VGA-I/O.J1_p3: J1.10
VGA-I/O.J1_p8: J1.8
VGA-I/O.J1_p9: J1.7
VGA-I/O.J1_p10: J1.6
VGA-I/O.J1_p11: J1.5
VGA-I/O.J1_p12: J1.4
VGA-I/O.J1_p13: J1.3
VGA-I/O.J1_p14: J1.2
VGA-I/O.J1_p15: J1.1
VGA-I/O.J2_p0: J2.6
VGA-I/O.J2_p1: J2.7
VGA-I/O.J2_p4: J2.3
VGA-I/O.J2_p5: J2.2
VGA-I/O.J2_p6: J2.4
VGA-I/O.J2_p7: J2.1
NetJ2_8: J2.8 P9.1
NetJ2_10: J2.10 P8.2
NetJ2_11: J2.11 P8.4

Not connected (* = marked no-connect by the designer): J1 11; J2 5; P8 1 3; P9 2

### Channels
VGA: designators end in _VGA#1
VGA: designators end in _VGA#2

### Buses and harness runs
harness VGA-I/O = port VGA-I/O

### Notes on the sheet
- (near J1) 5V line by cable if needed. Imponator be damned

### Library data of the parts
J1 J2 = Header 11H: Header, 11-Pin, Right Angle; LatestRevisionDate: 17-Jul-2002; LatestRevisionNote: Re-released for DXP Platform.; Publisher: Altium Limited
P8 = Header 2X2: Header, 2-Pin, Dual row; LatestRevisionDate: 17-Jul-2002; LatestRevisionNote: Re-released for DXP Platform.; Publisher: Altium Limited
P9 = Header 2: Header, 2-Pin; LatestRevisionDate: 17-Jul-2002; LatestRevisionNote: Re-released for DXP Platform.; Publisher: Altium Limited

## Sheet SRAM.SchDoc
size A
Used 2 times, as channels Data_mem1, Data_mem2. Parts and nets are listed once, with the designators drawn on the sheet.
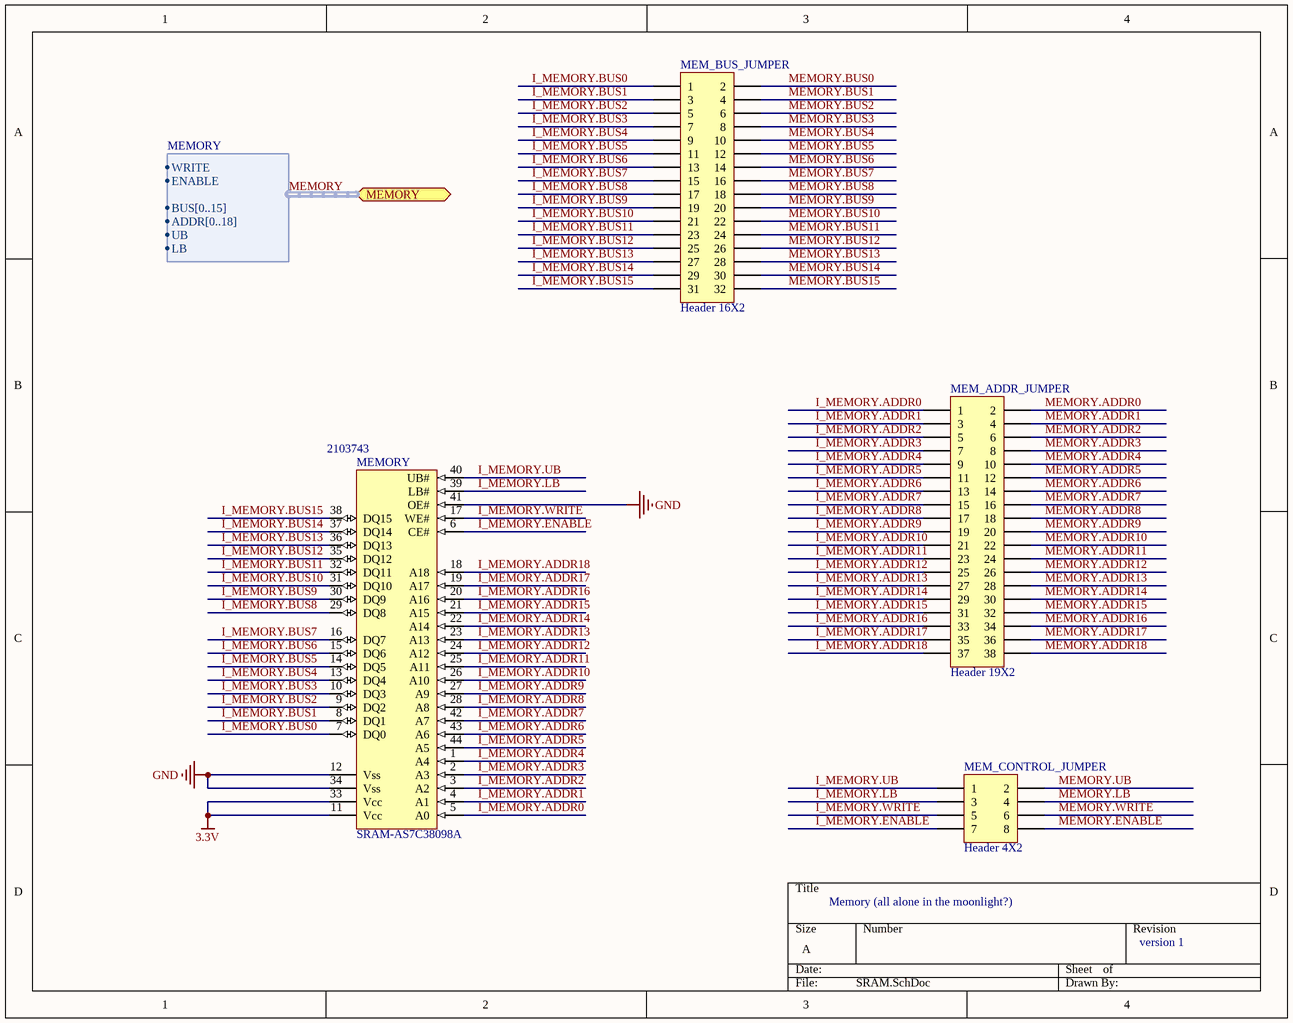
[diagram p8: SRAM.SchDoc]

### Parts
MEM_ADDR_JUMPER  Header 19X2  [HDR2X19]
MEM_BUS_JUMPER  Header 16X2  [HDR2X16]
MEM_CONTROL_JUMPER  Header 4X2  [HDR2X4]
MEMORY  SRAM-AS7C38098A  Supplier Part Number 1: 2103743  [AS7C38098A-10TIN]

### Ports
MEMORY (harness MEMORY)

### Harnesses
MEMORY: WRITE, ENABLE, BUS[0..15], ADDR[0..18], UB, LB

### Nets
3.3V: MEMORY.11(Vcc) MEMORY.33(Vcc)
GND: MEMORY.12(Vss) MEMORY.34(Vss) MEMORY.41(OE#)
I_MEMORY.ADDR0: MEM_ADDR_JUMPER.1 MEMORY.5(A0)
I_MEMORY.ADDR1: MEM_ADDR_JUMPER.3 MEMORY.4(A1)
I_MEMORY.ADDR2: MEM_ADDR_JUMPER.5 MEMORY.3(A2)
I_MEMORY.ADDR3: MEM_ADDR_JUMPER.7 MEMORY.2(A3)
I_MEMORY.ADDR4: MEM_ADDR_JUMPER.9 MEMORY.1(A4)
I_MEMORY.ADDR5: MEM_ADDR_JUMPER.11 MEMORY.44(A5)
I_MEMORY.ADDR6: MEM_ADDR_JUMPER.13 MEMORY.43(A6)
I_MEMORY.ADDR7: MEM_ADDR_JUMPER.15 MEMORY.42(A7)
I_MEMORY.ADDR8: MEM_ADDR_JUMPER.17 MEMORY.28(A8)
I_MEMORY.ADDR9: MEM_ADDR_JUMPER.19 MEMORY.27(A9)
I_MEMORY.ADDR10: MEM_ADDR_JUMPER.21 MEMORY.26(A10)
I_MEMORY.ADDR11: MEM_ADDR_JUMPER.23 MEMORY.25(A11)
I_MEMORY.ADDR12: MEM_ADDR_JUMPER.25 MEMORY.24(A12)
I_MEMORY.ADDR13: MEM_ADDR_JUMPER.27 MEMORY.23(A13)
I_MEMORY.ADDR14: MEM_ADDR_JUMPER.29 MEMORY.22(A14)
I_MEMORY.ADDR15: MEM_ADDR_JUMPER.31 MEMORY.21(A15)
I_MEMORY.ADDR16: MEM_ADDR_JUMPER.33 MEMORY.20(A16)
I_MEMORY.ADDR17: MEM_ADDR_JUMPER.35 MEMORY.19(A17)
I_MEMORY.ADDR18: MEM_ADDR_JUMPER.37 MEMORY.18(A18)
I_MEMORY.BUS0: MEM_BUS_JUMPER.1 MEMORY.7(DQ0)
I_MEMORY.BUS1: MEM_BUS_JUMPER.3 MEMORY.8(DQ1)
I_MEMORY.BUS2: MEM_BUS_JUMPER.5 MEMORY.9(DQ2)
I_MEMORY.BUS3: MEM_BUS_JUMPER.7 MEMORY.10(DQ3)
I_MEMORY.BUS4: MEM_BUS_JUMPER.9 MEMORY.13(DQ4)
I_MEMORY.BUS5: MEM_BUS_JUMPER.11 MEMORY.14(DQ5)
I_MEMORY.BUS6: MEM_BUS_JUMPER.13 MEMORY.15(DQ6)
I_MEMORY.BUS7: MEM_BUS_JUMPER.15 MEMORY.16(DQ7)
I_MEMORY.BUS8: MEM_BUS_JUMPER.17 MEMORY.29(DQ8)
I_MEMORY.BUS9: MEM_BUS_JUMPER.19 MEMORY.30(DQ9)
I_MEMORY.BUS10: MEM_BUS_JUMPER.21 MEMORY.31(DQ10)
I_MEMORY.BUS11: MEM_BUS_JUMPER.23 MEMORY.32(DQ11)
I_MEMORY.BUS12: MEM_BUS_JUMPER.25 MEMORY.35(DQ12)
I_MEMORY.BUS13: MEM_BUS_JUMPER.27 MEMORY.36(DQ13)
I_MEMORY.BUS14: MEM_BUS_JUMPER.29 MEMORY.37(DQ14)
I_MEMORY.BUS15: MEM_BUS_JUMPER.31 MEMORY.38(DQ15)
I_MEMORY.ENABLE: MEM_CONTROL_JUMPER.7 MEMORY.6(CE#)
I_MEMORY.LB: MEM_CONTROL_JUMPER.3 MEMORY.39(LB#)
I_MEMORY.UB: MEM_CONTROL_JUMPER.1 MEMORY.40(UB#)
I_MEMORY.WRITE: MEM_CONTROL_JUMPER.5 MEMORY.17(WE#)
MEMORY.ADDR0: MEM_ADDR_JUMPER.2
MEMORY.ADDR1: MEM_ADDR_JUMPER.4
MEMORY.ADDR2: MEM_ADDR_JUMPER.6
MEMORY.ADDR3: MEM_ADDR_JUMPER.8
MEMORY.ADDR4: MEM_ADDR_JUMPER.10
MEMORY.ADDR5: MEM_ADDR_JUMPER.12
MEMORY.ADDR6: MEM_ADDR_JUMPER.14
MEMORY.ADDR7: MEM_ADDR_JUMPER.16
MEMORY.ADDR8: MEM_ADDR_JUMPER.18
MEMORY.ADDR9: MEM_ADDR_JUMPER.20
MEMORY.ADDR10: MEM_ADDR_JUMPER.22
MEMORY.ADDR11: MEM_ADDR_JUMPER.24
MEMORY.ADDR12: MEM_ADDR_JUMPER.26
MEMORY.ADDR13: MEM_ADDR_JUMPER.28
MEMORY.ADDR14: MEM_ADDR_JUMPER.30
MEMORY.ADDR15: MEM_ADDR_JUMPER.32
MEMORY.ADDR16: MEM_ADDR_JUMPER.34
MEMORY.ADDR17: MEM_ADDR_JUMPER.36
MEMORY.ADDR18: MEM_ADDR_JUMPER.38
MEMORY.BUS0: MEM_BUS_JUMPER.2
MEMORY.BUS1: MEM_BUS_JUMPER.4
MEMORY.BUS2: MEM_BUS_JUMPER.6
MEMORY.BUS3: MEM_BUS_JUMPER.8
MEMORY.BUS4: MEM_BUS_JUMPER.10
MEMORY.BUS5: MEM_BUS_JUMPER.12
MEMORY.BUS6: MEM_BUS_JUMPER.14
MEMORY.BUS7: MEM_BUS_JUMPER.16
MEMORY.BUS8: MEM_BUS_JUMPER.18
MEMORY.BUS9: MEM_BUS_JUMPER.20
MEMORY.BUS10: MEM_BUS_JUMPER.22
MEMORY.BUS11: MEM_BUS_JUMPER.24
MEMORY.BUS12: MEM_BUS_JUMPER.26
MEMORY.BUS13: MEM_BUS_JUMPER.28
MEMORY.BUS14: MEM_BUS_JUMPER.30
MEMORY.BUS15: MEM_BUS_JUMPER.32
MEMORY.ENABLE: MEM_CONTROL_JUMPER.8
MEMORY.LB: MEM_CONTROL_JUMPER.4
MEMORY.UB: MEM_CONTROL_JUMPER.2
MEMORY.WRITE: MEM_CONTROL_JUMPER.6

### Channels
Data_mem1: designators end in _Data_mem1
Data_mem2: designators end in _Data_mem2

### Buses and harness runs
harness MEMORY = port MEMORY

### Notes on the sheet
- Memory (all alone in the moonlight?)
- version 1

### Library data of the parts
MEM_ADDR_JUMPER = Header 19X2: Header, 19-Pin, Dual row; LatestRevisionDate: 17-Jul-2002; LatestRevisionNote: Re-released for DXP Platform.; Publisher: Altium Limited
MEM_BUS_JUMPER = Header 16X2: Header, 16-Pin, Dual row; LatestRevisionDate: 17-Jul-2002; LatestRevisionNote: Re-released for DXP Platform.; Publisher: Altium Limited
MEM_CONTROL_JUMPER = Header 4X2: Header, 4-Pin, Dual row; LatestRevisionDate: 17-Jul-2002; LatestRevisionNote: Re-released for DXP Platform.; Publisher: Altium Limited
MEMORY = memchip-AS7C38098A: Manufacturer: ALLIANCE MEMORY; Description: ALLIANCE MEMORY - AS7C38098A-10TIN - SRAM, 8MBIT, 512KX16, 3.3V, 44TSOPII; Memory Size: 8; Memory Configuration: 512K x 16; Supply Voltage Min: 2.7; Supply Voltage Max: 3.6; Memory Case Style: TSOP-II; No. of Pins: 44; Access Time: 10; Supply Voltage Range: 2.7V to 3.6; Supplier 1: Farnell; Manufacturer Part Number: AS7C38098A-10TIN; RoHS: YES; Stock 1: 76; Pricing 1: 1=105,75, 10=104, 100=83,85, 250=82,2, 500=80,55, 900=78,95 (EUR); Operating Temperature Min: -40; Operating Temperature Max: 85; Packaging: Each; MSL: MSL 3 - 168 hours; Operating Temperature Range: -40°C to +85; ComponentLink1URL: http://www.alliancememory.com/pdf/sram/fa/as7c38098a.pdf; ComponentLink1Description: http://www.alliancememory.com/pdf/sram/fa/as7c38098a.pdf

## Sheet Serial.SchDoc
size A
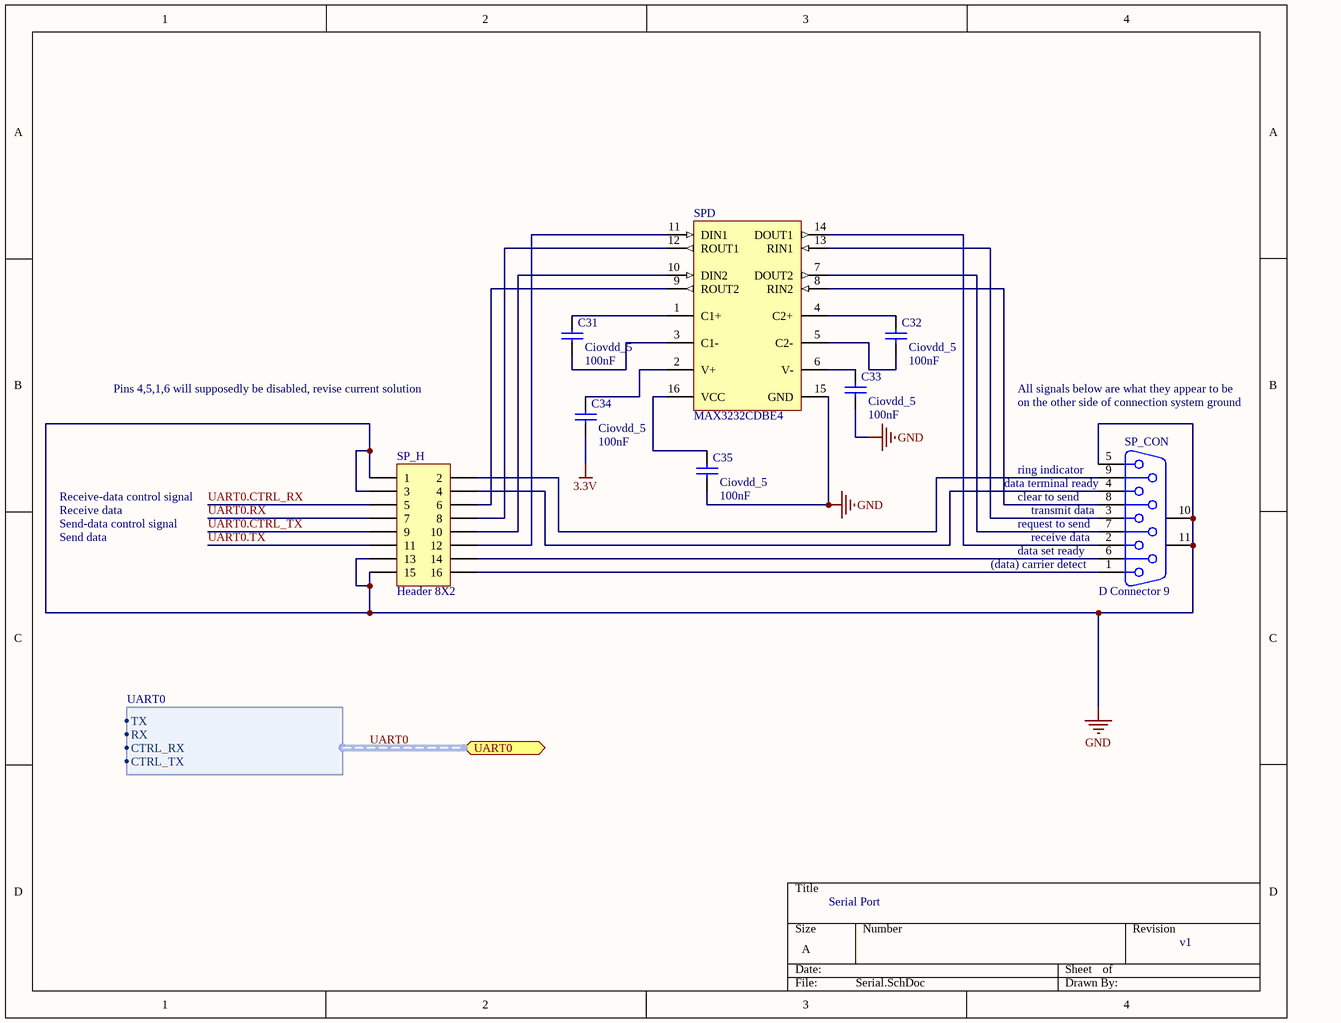
[diagram p9: Serial.SchDoc]

### Parts
C31  Ciovdd_5  value 100nF  [C1206]
C32  Ciovdd_5  value 100nF  [C1206]
C33  Ciovdd_5  value 100nF  [C1206]
C34  Ciovdd_5  value 100nF  [C1206]
C35  Ciovdd_5  value 100nF  [C1206]
SP_CON  D Connector 9  [DSUB1.385-2H9]
SP_H  Header 8X2  [HDR2X8]
SPD  MAX3232CDBE4  [TI-DB16_L]

### Ports
UART0 (harness UART0)

### Harnesses
UART0: TX, RX, CTRL_RX, CTRL_TX

### Nets
3.3V: C34.1
GND: C33.1 C35.1 SP_CON.5 SP_CON.10(MH1) SP_CON.11(MH2) SP_H.1 SP_H.3 SP_H.13 SP_H.15 SPD.15(GND)
UART0.CTRL_RX: SP_H.5
UART0.CTRL_TX: SP_H.9
UART0.RX: SP_H.7
UART0.TX: SP_H.11
NetC31_1: C31.1 SPD.3(C1-)
NetC31_2: C31.2 SPD.1(C1+)
NetC32_1: C32.1 SPD.5(C2-)
NetC32_2: C32.2 SPD.4(C2+)
NetC33_2: C33.2 SPD.6(V-)
NetC34_2: C34.2 SPD.2(V+)
NetC35_2: C35.2 SPD.16(VCC)
NetSP_CON_1: SP_CON.1 SP_H.16
NetSP_CON_2: SP_CON.2 SPD.14(DOUT1)
NetSP_CON_3: SP_CON.3 SPD.13(RIN1)
NetSP_CON_4: SP_CON.4 SP_H.4
NetSP_CON_6: SP_CON.6 SP_H.14
NetSP_CON_7: SP_CON.7 SPD.7(DOUT2)
NetSP_CON_8: SP_CON.8 SPD.8(RIN2)
NetSP_CON_9: SP_CON.9 SP_H.2
NetSP_H_6: SP_H.6 SPD.9(ROUT2)
NetSP_H_8: SP_H.8 SPD.12(ROUT1)
NetSP_H_10: SP_H.10 SPD.10(DIN2)
NetSP_H_12: SP_H.12 SPD.11(DIN1)

### Buses and harness runs
harness UART0 = port UART0

### Notes on the sheet
- Pins 4,5,1,6 will supposedly be disabled, revise current solution
- on the other side of connection system ground
- All signals below are what they appear to be
- Receive-data control signal
- (near SP_CON) data terminal ready
- (near SP_CON) clear to send
- (near SP_CON) ring indicator
- Send data
- Send-data control signal
- Receive data
- (near SP_CON) (data) carrier detect
- (near SP_CON) request to send
- (near SP_CON) data set ready
- (near SP_CON) transmit data
- (near SP_CON) receive data
- Serial Port
- v1

### Library data of the parts
C31-C35 = Cap Semi: Capacitor (Semiconductor SIM Model); Manufacturer: AVX; Manufacturer Part Number: 02016D104KAT2A; Capacitance: 0.1; Capacitance Tolerance: ± 10%; Dielectric Characteristic: X5; Voltage Rating: 6.3; Ceramic Capacitor Case: 0201 [0603 Metric]; SVHC: No SVHC (16-Dec-2013); Capacitor Terminals: SMD; Reel Quantity: 15000; Published: 8-Jun-2000; LatestRevisionDate: 29-May-2009; LatestRevisionNote: IPC-7351 Footprint Added.; PackageReference: C1206; Publisher: Altium Limited; PackageDescription: Chip Capacitor; Supplier 1: Farnell; Supplier Part Number 1: 2280755; RoHS: YES; Stock 1: 30000; Pricing 1: 15000=0.0827, 75000=0.062, 150000=0.0517 (EUR); Product Range: -; Operating Temperature Min: -55; Operating Temperature Max: 85; Packaging: Tape & Reel; MSL: MSL 1 - Unlimited; Capacitance Tolerance ±: ± 10%; Capacitor Case Style: 0201 [0603 Metric]; Operating Temperature Range: -55°C to +85; ComponentLink1URL: http://www.farnell.com/datasheets/1666675.pdf; ComponentLink1Description: http://www.farnell.com/datasheets/1666675.pdf
SP_CON = D Connector 9: Receptacle Assembly, 9 Position, Right Angle; PackageDocument: O; Positions: 9; Published: 15-Jun-2001; LatestRevisionDate: 17-Jul-2002; LatestRevisionNote: Re-released for DXP Platform.; DatasheetDocument: 1-Sep-1999; PackageReference: 788750; Publisher: Altium Limited; Orientation: Right Angle; Gender: Receptacle
SP_H = Header 8X2: Header, 8-Pin, Dual row; LatestRevisionDate: 17-Jul-2002; LatestRevisionNote: Re-released for DXP Platform.; Publisher: Altium Limited
SPD = CMP-0299-01177-1: 3-V to 5.5-V Multichannel RS-232 Line Driver / Receiver with ±15-kV ESD Protection, 0 to 70 degC, 16-Pin SSOP (DB), Green (RoHS & no Sb/Br); RS-232: TRUE; Supply Voltage(s)(V): 3.3 or 5.0; ESD HBM(kV): +/-15; ICC(Max)(mA): 1; Drivers Per Package: 2; SubFamily: RS-232; ComponentLink1URL: www.ti.com; ComponentLink3Description: Package Specification; PackageDescription: 16-Pin Plastic Small Outline Package, 6.2 x 5.3 mm Body, 0.65 mm Pitch; ComponentLink2URL: http://www.ti.com/general/docs/lit/getliterature.tsp?genericPartNumber=MAX3232&fileType=pdf; Single Supply: TRUE; ComponentLink3URL: http://www.ti.com/litv/pdf/msso002e; PackageVersion: revE, Dec-2001; ComponentLink1Description: Manufacturer URL; ComponentLink2Description: Datasheet; Receivers Per Package: 2; DatasheetVersion: SLLS410I; PackageReference: DB16

## Sheet FPGA_IO_1.SchDoc
size A
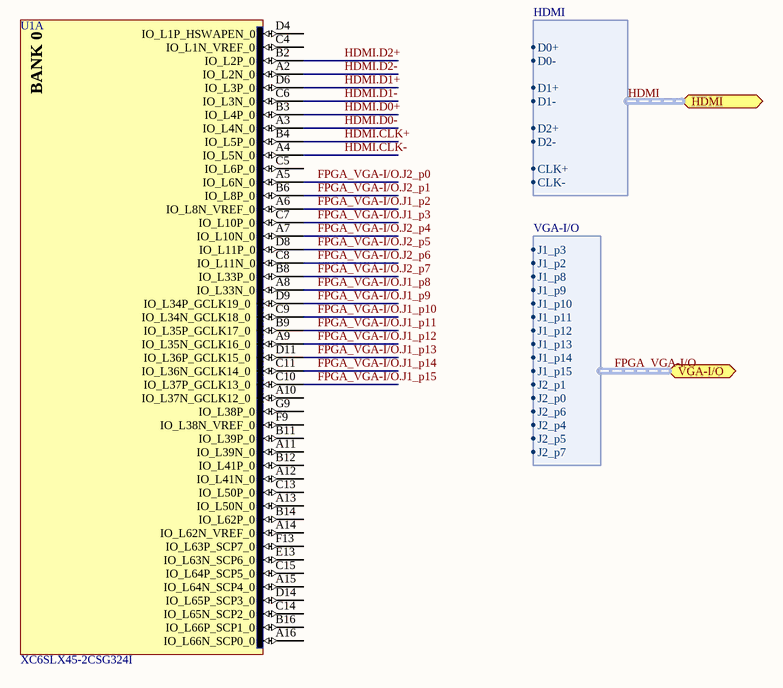
[diagram p10: FPGA_IO_1.SchDoc]

### Parts
U1  XC6SLX45-2CSG324I  [CSG324]  (part A of 8)

### Ports
HDMI (harness HDMI), VGA-I/O (harness VGA-I/O)

### Harnesses
HDMI: D0+, D0-, D1+, D1-, D2+, D2-, CLK+, CLK-
VGA-I/O: J2_p7, J2_p5, J2_p4, J2_p6, J2_p0, J2_p1, J1_p15, J1_p14, J1_p13, J1_p12, J1_p11, J1_p10, J1_p9, J1_p8, J1_p2, J1_p3

### Nets
FPGA_VGA-I/O.J1_p2: U1.A6(IO_L8N_VREF_0)
FPGA_VGA-I/O.J1_p3: U1.C7(IO_L10P_0)
FPGA_VGA-I/O.J1_p8: U1.A8(IO_L33N_0)
FPGA_VGA-I/O.J1_p9: U1.D9(IO_L34P_GCLK19_0)
FPGA_VGA-I/O.J1_p10: U1.C9(IO_L34N_GCLK18_0)
FPGA_VGA-I/O.J1_p11: U1.B9(IO_L35P_GCLK17_0)
FPGA_VGA-I/O.J1_p12: U1.A9(IO_L35N_GCLK16_0)
FPGA_VGA-I/O.J1_p13: U1.D11(IO_L36P_GCLK15_0)
FPGA_VGA-I/O.J1_p14: U1.C11(IO_L36N_GCLK14_0)
FPGA_VGA-I/O.J1_p15: U1.C10(IO_L37P_GCLK13_0)
FPGA_VGA-I/O.J2_p0: U1.A5(IO_L6N_0)
FPGA_VGA-I/O.J2_p1: U1.B6(IO_L8P_0)
FPGA_VGA-I/O.J2_p4: U1.A7(IO_L10N_0)
FPGA_VGA-I/O.J2_p5: U1.D8(IO_L11P_0)
FPGA_VGA-I/O.J2_p6: U1.C8(IO_L11N_0)
FPGA_VGA-I/O.J2_p7: U1.B8(IO_L33P_0)
HDMI.CLK+: U1.B4(IO_L5P_0)
HDMI.CLK-: U1.A4(IO_L5N_0)
HDMI.D0+: U1.B3(IO_L4P_0)
HDMI.D0-: U1.A3(IO_L4N_0)
HDMI.D1+: U1.D6(IO_L3P_0)
HDMI.D1-: U1.C6(IO_L3N_0)
HDMI.D2+: U1.B2(IO_L2P_0)
HDMI.D2-: U1.A2(IO_L2N_0)

Not connected (* = marked no-connect by the designer): U1 A10(IO_L37N_GCLK12_0) A11(IO_L39N_0) A12(IO_L41N_0) A13(IO_L50N_0) A14(IO_L62N_VREF_0) A15(IO_L64N_SCP4_0) A16(IO_L66N_SCP0_0) B11(IO_L39P_0) B12(IO_L41P_0) B14(IO_L62P_0) B16(IO_L66P_SCP1_0) C4(IO_L1N_VREF_0) C5(IO_L6P_0) C13(IO_L50P_0) C14(IO_L65N_SCP2_0) C15(IO_L64P_SCP5_0) D4(IO_L1P_HSWAPEN_0) D14(IO_L65P_SCP3_0) E13(IO_L63N_SCP6_0) F9(IO_L38N_VREF_0) F13(IO_L63P_SCP7_0) G9(IO_L38P_0)

### Buses and harness runs
harness FPGA_VGA-I/O = port VGA-I/O
harness HDMI = port HDMI

### Notes on the sheet
- (in symbol CMP-0067-00402-1, part A) BANK 0

### Library data of the parts
U1 = CMP-0067-00402-1: as FPGA on sheet FPGA_IO_3; Code_JEDEC: MO-275-KKAC-1; PackageDescription: 324-Ball Chip-Scale BGA (CSG324) Package, 0.8 mm Pitch; DatasheetVersion: ver1.6, Nov-2010; PackageVersion: ver1.1, Nov-2009; PackageReference: CSG324

## Sheet FPGA_IO_2.SchDoc
size A
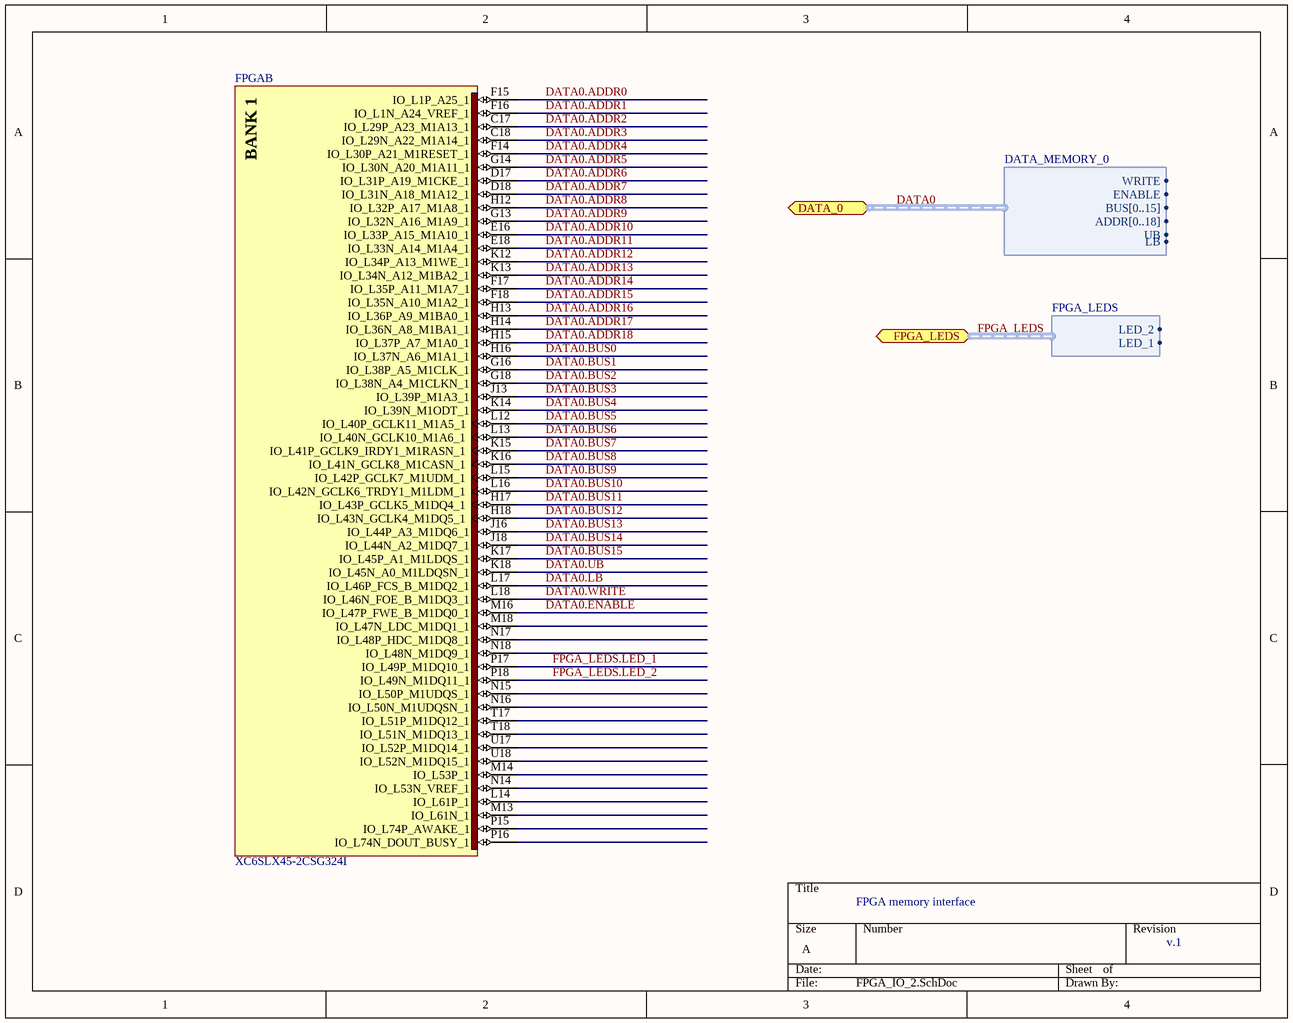
[diagram p11: FPGA_IO_2.SchDoc]

### Parts
FPGA  XC6SLX45-2CSG324I  [CSG324]  (part B of 8)

### Ports
DATA_0 (harness DATA_MEMORY_0), FPGA_LEDS (harness FPGA_LEDS)

### Harnesses
DATA_MEMORY_0: WRITE, ENABLE, BUS[0..15], ADDR[0..18], UB, LB
FPGA_LEDS: LED_1, LED_2

### Nets
DATA0.ADDR0: FPGA.F15(IO_L1P_A25_1)
DATA0.ADDR1: FPGA.F16(IO_L1N_A24_VREF_1)
DATA0.ADDR2: FPGA.C17(IO_L29P_A23_M1A13_1)
DATA0.ADDR3: FPGA.C18(IO_L29N_A22_M1A14_1)
DATA0.ADDR4: FPGA.F14(IO_L30P_A21_M1RESET_1)
DATA0.ADDR5: FPGA.G14(IO_L30N_A20_M1A11_1)
DATA0.ADDR6: FPGA.D17(IO_L31P_A19_M1CKE_1)
DATA0.ADDR7: FPGA.D18(IO_L31N_A18_M1A12_1)
DATA0.ADDR8: FPGA.H12(IO_L32P_A17_M1A8_1)
DATA0.ADDR9: FPGA.G13(IO_L32N_A16_M1A9_1)
DATA0.ADDR10: FPGA.E16(IO_L33P_A15_M1A10_1)
DATA0.ADDR11: FPGA.E18(IO_L33N_A14_M1A4_1)
DATA0.ADDR12: FPGA.K12(IO_L34P_A13_M1WE_1)
DATA0.ADDR13: FPGA.K13(IO_L34N_A12_M1BA2_1)
DATA0.ADDR14: FPGA.F17(IO_L35P_A11_M1A7_1)
DATA0.ADDR15: FPGA.F18(IO_L35N_A10_M1A2_1)
DATA0.ADDR16: FPGA.H13(IO_L36P_A9_M1BA0_1)
DATA0.ADDR17: FPGA.H14(IO_L36N_A8_M1BA1_1)
DATA0.ADDR18: FPGA.H15(IO_L37P_A7_M1A0_1)
DATA0.BUS0: FPGA.H16(IO_L37N_A6_M1A1_1)
DATA0.BUS1: FPGA.G16(IO_L38P_A5_M1CLK_1)
DATA0.BUS2: FPGA.G18(IO_L38N_A4_M1CLKN_1)
DATA0.BUS3: FPGA.J13(IO_L39P_M1A3_1)
DATA0.BUS4: FPGA.K14(IO_L39N_M1ODT_1)
DATA0.BUS5: FPGA.L12(IO_L40P_GCLK11_M1A5_1)
DATA0.BUS6: FPGA.L13(IO_L40N_GCLK10_M1A6_1)
DATA0.BUS7: FPGA.K15(IO_L41P_GCLK9_IRDY1_M1RASN_1)
DATA0.BUS8: FPGA.K16(IO_L41N_GCLK8_M1CASN_1)
DATA0.BUS9: FPGA.L15(IO_L42P_GCLK7_M1UDM_1)
DATA0.BUS10: FPGA.L16(IO_L42N_GCLK6_TRDY1_M1LDM_1)
DATA0.BUS11: FPGA.H17(IO_L43P_GCLK5_M1DQ4_1)
DATA0.BUS12: FPGA.H18(IO_L43N_GCLK4_M1DQ5_1)
DATA0.BUS13: FPGA.J16(IO_L44P_A3_M1DQ6_1)
DATA0.BUS14: FPGA.J18(IO_L44N_A2_M1DQ7_1)
DATA0.BUS15: FPGA.K17(IO_L45P_A1_M1LDQS_1)
DATA0.ENABLE: FPGA.M16(IO_L47P_FWE_B_M1DQ0_1)
DATA0.LB: FPGA.L17(IO_L46P_FCS_B_M1DQ2_1)
DATA0.UB: FPGA.K18(IO_L45N_A0_M1LDQSN_1)
DATA0.WRITE: FPGA.L18(IO_L46N_FOE_B_M1DQ3_1)
FPGA_LEDS.LED_1: FPGA.P17(IO_L49P_M1DQ10_1)
FPGA_LEDS.LED_2: FPGA.P18(IO_L49N_M1DQ11_1)

Not connected (* = marked no-connect by the designer): FPGA L14(IO_L61P_1) M13(IO_L61N_1) M14(IO_L53P_1) M18(IO_L47N_LDC_M1DQ1_1) N14(IO_L53N_VREF_1) N15(IO_L50P_M1UDQS_1) N16(IO_L50N_M1UDQSN_1) N17(IO_L48P_HDC_M1DQ8_1) N18(IO_L48N_M1DQ9_1) P15(IO_L74P_AWAKE_1) P16(IO_L74N_DOUT_BUSY_1) T17(IO_L51P_M1DQ12_1) T18(IO_L51N_M1DQ13_1) U17(IO_L52P_M1DQ14_1) U18(IO_L52N_M1DQ15_1)

### Buses and harness runs
harness DATA0 = port DATA_0
harness FPGA_LEDS = port FPGA_LEDS

### Notes on the sheet
- FPGA memory interface
- v.1
- (in symbol CMP-0067-00402-1, part B) BANK 1

### Library data of the parts
FPGA = CMP-0067-00402-1: as FPGA on sheet FPGA_IO_3; Code_JEDEC: MO-275-KKAC-1; PackageDescription: 324-Ball Chip-Scale BGA (CSG324) Package, 0.8 mm Pitch; DatasheetVersion: ver1.6, Nov-2010; PackageVersion: ver1.1, Nov-2009; PackageReference: CSG324